# Altium project HYDRA_V4_LINK.PrjPcb (part 1 of 2)
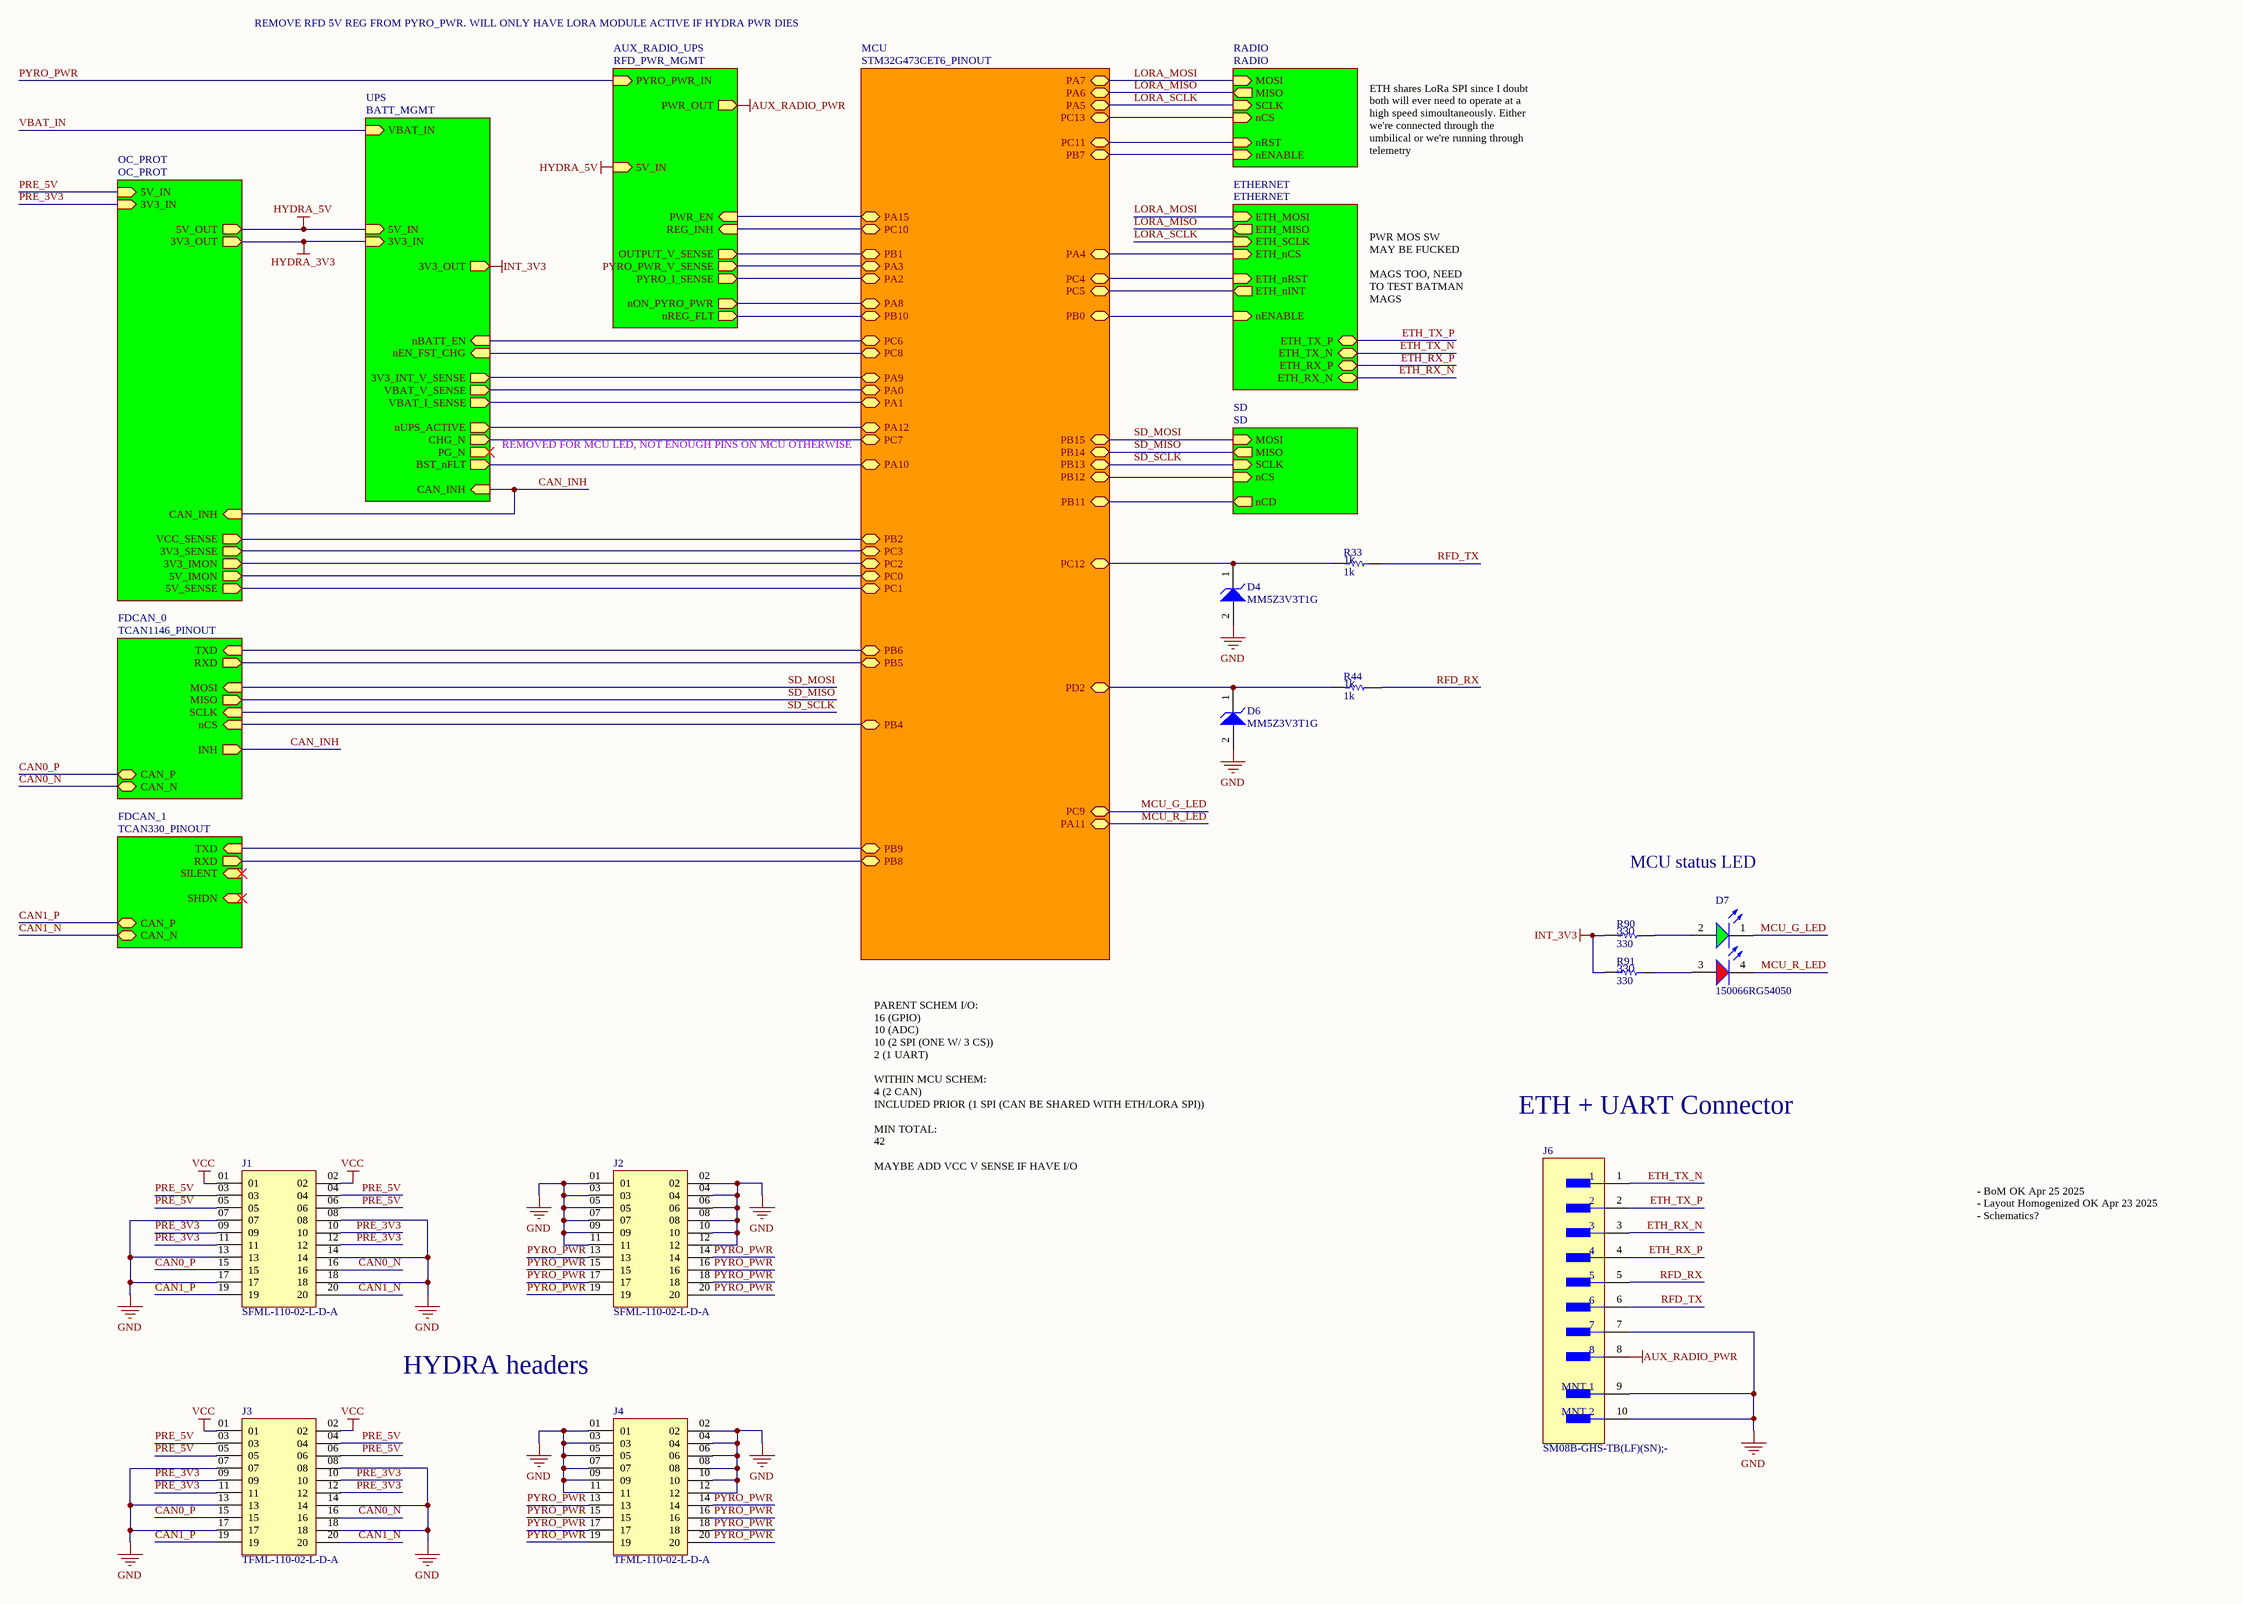
[diagram p0: HYDRA_V4_LINK.SchDoc]
10 sheets, 197 parts. Net scope: hierarchical (ports join the sheet entries above them; power ports are global).
Board files: HYDRA_V4_LINK_OLD.PcbDoc, HYDRA_V4_LINK_V2.PcbDoc
Sheets:
  HYDRA_V4_LINK.SchDoc
    OC_PROT = OC_PROT.SchDoc
    UPS = BATT_MGMT.SchDoc
    MCU = STM32G473CET6_PINOUT.SchDoc
    SD = SD.SchDoc
    AUX_RADIO_UPS = RFD_PWR_MGMT.SchDoc
    ETHERNET = ETHERNET.SchDoc
    RADIO = RADIO.SchDoc
    FDCAN_1 = TCAN330_PINOUT.SchDoc
    FDCAN_0 = TCAN1146_PINOUT.SchDoc

## Sheet HYDRA_V4_LINK.SchDoc
size C; SheetNumber: 1; SheetTotal: 10

### Parts
D4  MM5Z3V3T1G  [ONSC-SOD-523-2-502-01_V]
D6  MM5Z3V3T1G  [ONSC-SOD-523-2-502-01_V]
D7  150066RG54050  [WL-SBCD_0606]
J1  SFML-110-02-L-D-A  [SFML-110-02-L-D-A-Footprint-1]
J2  SFML-110-02-L-D-A  [SFML-110-02-L-D-A-Footprint-1]
J3  TFML-110-02-L-D-A  [TFML-110-02-L-D-A-Footprint-1]
J4  TFML-110-02-L-D-A  [TFML-110-02-L-D-A-Footprint-1]
J6  SM08B-GHS-TB(LF)(SN);-  [SM08B-GHS-TB(LF)(SN);--Footprint-1]
R33  1k  [R0603B]
R44  1k  [R0603B]
R90  330  [R0603B]
R91  330  [R0603B]

### Sub-sheets
AUX_RADIO_UPS = RFD_PWR_MGMT: 5V_IN (in), PYRO_PWR_IN (in), PWR_OUT (out), PWR_EN (in), OUTPUT_V_SENSE (out), PYRO_PWR_V_SENSE (out), PYRO_I_SENSE (out), nON_PYRO_PWR (out), nREG_FLT (out), REG_INH (in)
ETHERNET = ETHERNET: ETH_MOSI (in), ETH_MISO (out), ETH_SCLK (in), ETH_nCS (in), ETH_nRST (in), ETH_nINT (out), ETH_TX_P (bidir), ETH_TX_N (bidir), ETH_RX_P (bidir), ETH_RX_N (bidir), nENABLE (in)
FDCAN_0 = TCAN1146_PINOUT: TXD (in), RXD (out), MOSI (in), MISO (out), SCLK (in), nCS (in), INH (out), CAN_P (bidir), CAN_N (bidir)
FDCAN_1 = TCAN330_PINOUT: TXD (in), RXD (out), SHDN (in), SILENT (in), CAN_P (bidir), CAN_N (bidir)
MCU = STM32G473CET6_PINOUT: PA4 (bidir), PA5 (bidir), PA6 (bidir), PA7 (bidir), PC4 (bidir), PC5 (bidir), PC12 (bidir), PD2 (bidir), PB5 (bidir), PB6 (bidir), PB4 (bidir), PB9 (bidir), PB8 (bidir), PB12 (bidir), PB13 (bidir), PB14 (bidir), PB15 (bidir), PB11 (bidir), PC13 (bidir), PB7 (bidir), PA15 (bidir), PC10 (bidir), PC0 (bidir), PC1 (bidir), PC2 (bidir), PC3 (bidir), PA0 (bidir), PA1 (bidir), PA2 (bidir), PA3 (bidir), PB2 (bidir), PB1 (bidir), PA9 (bidir), PB0 (bidir), PC11 (bidir), PB10 (bidir), PC6 (bidir), PC7 (bidir), PC8 (bidir), PC9 (bidir), PA8 (bidir), PA10 (bidir), PA12 (bidir), PA11 (bidir)
OC_PROT = OC_PROT: 5V_IN (in), 3V3_IN (in), 5V_OUT (out), 3V3_OUT (out), CAN_INH (in), 3V3_SENSE (out), 3V3_IMON (out), 5V_IMON (out), 5V_SENSE (out), VCC_SENSE (out)
RADIO = RADIO: MOSI (in), MISO (out), SCLK (in), nCS (in), nRST (in), nENABLE (in)
SD = SD: MOSI (in), MISO (out), SCLK (in), nCS (in), nCD (out)
UPS = BATT_MGMT: 5V_IN (in), 3V3_IN (in), 3V3_OUT (out), VBAT_IN (in), nBATT_EN (in), nEN_FST_CHG (in), VBAT_V_SENSE (out), 3V3_INT_V_SENSE (out), VBAT_I_SENSE (out), nUPS_ACTIVE (out), CHG_N (out), PG_N (out), BST_nFLT (out), CAN_INH (in)

### Nets
AUX_RADIO_PWR: J6.8 ; sheet AUX_RADIO_UPS/PWR_OUT
GND: D4.2(A) D6.2(A) J1.07 J1.08 J1.13 J1.14 J1.17 J1.18 J2.01 J2.02 J2.03 J2.04 J2.05 J2.06 J2.07 J2.08 J2.09 J2.10 J2.11 J2.12 J3.07 J3.08 J3.13 J3.14 J3.17 J3.18 J4.01 J4.02 J4.03 J4.04 J4.05 J4.06 J4.07 J4.08 J4.09 J4.10 J4.11 J4.12 J6.7 J6.9(MNT_1) J6.10(MNT_2)
HYDRA_3V3: sheet OC_PROT/3V3_OUT, sheet UPS/3V3_IN  [project net 3V3_OUT]
HYDRA_5V: sheet OC_PROT/5V_OUT, sheet UPS/5V_IN, sheet AUX_RADIO_UPS/5V_IN  [project net 5V]
INT_3V3: R90.2 R91.2 ; sheet UPS/3V3_OUT
VCC: J1.01 J1.02 J3.01 J3.02
BATT_TS: sheet UPS/nBATT_EN, sheet MCU/PC6
BST_nFLT: sheet UPS/BST_nFLT, sheet MCU/PA10
CAN0_N: J1.16 J3.16 ; sheet FDCAN_0/CAN_N
CAN0_P: J1.15 J3.15 ; sheet FDCAN_0/CAN_P
CAN1_N: J1.20 J3.20 ; sheet FDCAN_1/CAN_N
CAN1_P: J1.19 J3.19 ; sheet FDCAN_1/CAN_P
CAN_INH: sheet OC_PROT/CAN_INH, sheet UPS/CAN_INH, sheet FDCAN_0/INH
CHG_N: sheet UPS/CHG_N, sheet MCU/PC7
ETH_nCS: sheet MCU/PA4, sheet ETHERNET/ETH_nCS
ETH_nINT: sheet MCU/PC5, sheet ETHERNET/ETH_nINT
ETH_nRST: sheet MCU/PC4, sheet ETHERNET/ETH_nRST
ETH_RX_N: J6.3 ; sheet ETHERNET/ETH_RX_N
ETH_RX_P: J6.4 ; sheet ETHERNET/ETH_RX_P
ETH_TX_N: J6.1 ; sheet ETHERNET/ETH_TX_N
ETH_TX_P: J6.2 ; sheet ETHERNET/ETH_TX_P
ISET2: sheet UPS/nEN_FST_CHG, sheet MCU/PC8
LORA_MISO: sheet MCU/PA6, sheet ETHERNET/ETH_MISO, sheet RADIO/MISO  [project net ETH_MISO]
LORA_MOSI: sheet MCU/PA7, sheet ETHERNET/ETH_MOSI, sheet RADIO/MOSI  [project net ETH_MOSI]
LORA_SCLK: sheet MCU/PA5, sheet ETHERNET/ETH_SCLK, sheet RADIO/SCLK  [project net ETH_SCLK]
MCU_G_LED: D7.1(K) ; sheet MCU/PC9
MCU_R_LED: D7.4(K) ; sheet MCU/PA11
nREG_FLT: sheet MCU/PB10, sheet AUX_RADIO_UPS/nREG_FLT
PRE_3V3: J1.09 J1.10 J1.11 J1.12 J3.09 J3.10 J3.11 J3.12 ; sheet OC_PROT/3V3_IN
PRE_5V: J1.03 J1.04 J1.05 J1.06 J3.03 J3.04 J3.05 J3.06 ; sheet OC_PROT/5V_IN
PYRO_PWR: J2.13 J2.14 J2.15 J2.16 J2.17 J2.18 J2.19 J2.20 J4.13 J4.14 J4.15 J4.16 J4.17 J4.18 J4.19 J4.20 ; sheet AUX_RADIO_UPS/PYRO_PWR_IN
RFD_RX: J6.5 R44.1
RFD_TX: J6.6 R33.1
SD_CD: sheet MCU/PB11, sheet SD/nCD
SD_CS: sheet MCU/PB12, sheet SD/nCS
SD_MISO: sheet MCU/PB14, sheet SD/MISO, sheet FDCAN_0/MISO  [project net SD_DAT0]
SD_MOSI: sheet MCU/PB15, sheet SD/MOSI, sheet FDCAN_0/MOSI  [project net SD_CMD]
SD_SCLK: sheet MCU/PB13, sheet SD/SCLK, sheet FDCAN_0/SCLK  [project net SD_CLK]
NetD4_1: D4.1(K) R33.2 ; sheet MCU/PC12
NetD6_1: D6.1(K) R44.2 ; sheet MCU/PD2
NetD7_2: D7.2(A) R90.1
NetD7_3: D7.3(A) R91.1
NetQ3_2: sheet MCU/PC10, sheet AUX_RADIO_UPS/REG_INH
NetQ3_5: sheet MCU/PA15, sheet AUX_RADIO_UPS/PWR_EN
NetR3_1: sheet OC_PROT/5V_SENSE, sheet MCU/PC1
NetR5_1: sheet OC_PROT/5V_IMON, sheet MCU/PC0
NetR11_1: sheet OC_PROT/3V3_SENSE, sheet MCU/PC3
NetR13_1: sheet OC_PROT/3V3_IMON, sheet MCU/PC2
NetR24_2: sheet UPS/VBAT_V_SENSE, sheet MCU/PA0
NetR27_2: sheet UPS/nUPS_ACTIVE, sheet MCU/PA12
NetR28_2: sheet UPS/3V3_INT_V_SENSE, sheet MCU/PA9
NetR34_1: sheet MCU/PB7, sheet RADIO/nENABLE
NetR42_1: sheet MCU/PA3, sheet AUX_RADIO_UPS/PYRO_PWR_V_SENSE
NetR56_1: sheet MCU/PB1, sheet AUX_RADIO_UPS/OUTPUT_V_SENSE
NetR58_2: sheet MCU/PA8, sheet AUX_RADIO_UPS/nON_PYRO_PWR
NetR81_1: sheet MCU/PB0, sheet ETHERNET/nENABLE
NetR83_1: sheet OC_PROT/VCC_SENSE, sheet MCU/PB2
NetU4_11: sheet UPS/VBAT_I_SENSE, sheet MCU/PA1
NetU7_4: sheet MCU/PC11, sheet RADIO/nRST
NetU7_15: sheet MCU/PC13, sheet RADIO/nCS
NetU8_11: sheet MCU/PA2, sheet AUX_RADIO_UPS/PYRO_I_SENSE
NetU12_57: sheet MCU/PB4, sheet FDCAN_0/nCS
NetU12_58: sheet MCU/PB5, sheet FDCAN_0/RXD
NetU12_59: sheet MCU/PB6, sheet FDCAN_0/TXD
NetU12_61: sheet MCU/PB8, sheet FDCAN_1/RXD
NetU12_62: sheet MCU/PB9, sheet FDCAN_1/TXD

### Notes on the sheet
- REMOVE RFD 5V REG FROM PYRO_PWR. WILL ONLY HAVE LORA MODULE ACTIVE IF HYDRA PWR DIES
- ETH shares LoRa SPI since I doubt both will ever need to operate at a high speed simoultaneously. Either we're connected through the umbilical or we're running through telemetry
- PWR MOS SW MAY BE FUCKED
  MAGS TOO, NEED TO TEST BATMAN MAGS
- REMOVED FOR MCU LED, NOT ENOUGH PINS ON MCU OTHERWISE
- MCU status LED
- ETH + UART Connector
- PARENT SCHEM I/O:
  16 (GPIO)
  10 (ADC)
  10 (2 SPI (ONE W/ 3 CS))
  2 (1 UART)
  WITHIN MCU SCHEM:
  4 (2 CAN)
  INCLUDED PRIOR (1 SPI (CAN BE SHARED WITH ETH/LORA SPI))
  MIN TOTAL:
  42
  MAYBE ADD VCC V SENSE IF HAVE I/O
- - BoM OK Apr 25 2025
  - Layout Homogenized OK Apr 23 2025
  - Schematics?
- HYDRA headers

### Library data of the parts
D4 D6 = CMP-1060-00750-1: Zener Voltage Regulator, 500 mW, 2-Pin SOD-523, Pb-Free, Tape and Reel; Manufacturer: On Semiconductor; P Max (W): 0.5; VZ Typ (V): 3.3; RoHS: Pb-Free; ComponentLink2Description: Datasheet; PackageReference: SOD-523-2-502-01; DatasheetVersion: Rev. 10; ComponentLink1Description: Manufacturer URL; PackageVersion: Rev. E, 09/2010; ComponentLink3URL: http://www.onsemi.com/pub_link/Collateral/502-01.PDF; ComponentLink2URL: http://www.onsemi.cn/pub_link/Collateral/MM5Z2V4T1-D.PDF; Mounting Technology: Surface Mount; PartNumber: MM5Z3V3T1G; Packing: Tape and Reel; PackageDescription: 2-Pin SOD, Body 1.2 x 0.8 mm; ComponentLink1URL: http://www.onsemi.com/; ComponentLink3Description: Package Specification
D7 = CMP-004-00040-2: Led, Red/Grn, 180Mcd/230Mcd, 624Nm/525Nm Rohs Compliant: Yes; Source: rgled.SchLib; Component Type: Standard; Design Item ID: CMP-004-00034-2; Pins: 4
J1 J2 = CMP-002-00043-1: Board Connector, 20 Contact(s), 2 Row(s), Female, Straight, 0.05 inch Pitch, Surface Mount Terminal, Locking, Black Insulator, Socket; RoHS Compliant: Yes; Connector Type: BOARD CONNECTOR; Mounting Technology: Board
J3 J4 = CMP-002-00042-3: Board Connector, 20 Contact(s), 2 Row(s), Male, Straight, Surface Mount Terminal; Connector Type: BOARD CONNECTOR; Mounting Technology: Board; RoHS Compliant: Yes
J6 = CMP-002-00079-3: Connector Header, GH Series, 8 Position, 1.25mm, 30-26 AWG, 50V, Surface Mount, Right Angle, Solder, Locking Ramp
R33 R44 R90 R91 = CMP-009-00002-14: Resistor
  R33 R44: Value: 1k
  R90 R91: Value: 330

## Sheet OC_PROT.SchDoc
size C; SheetNumber: 2; SheetTotal: 10
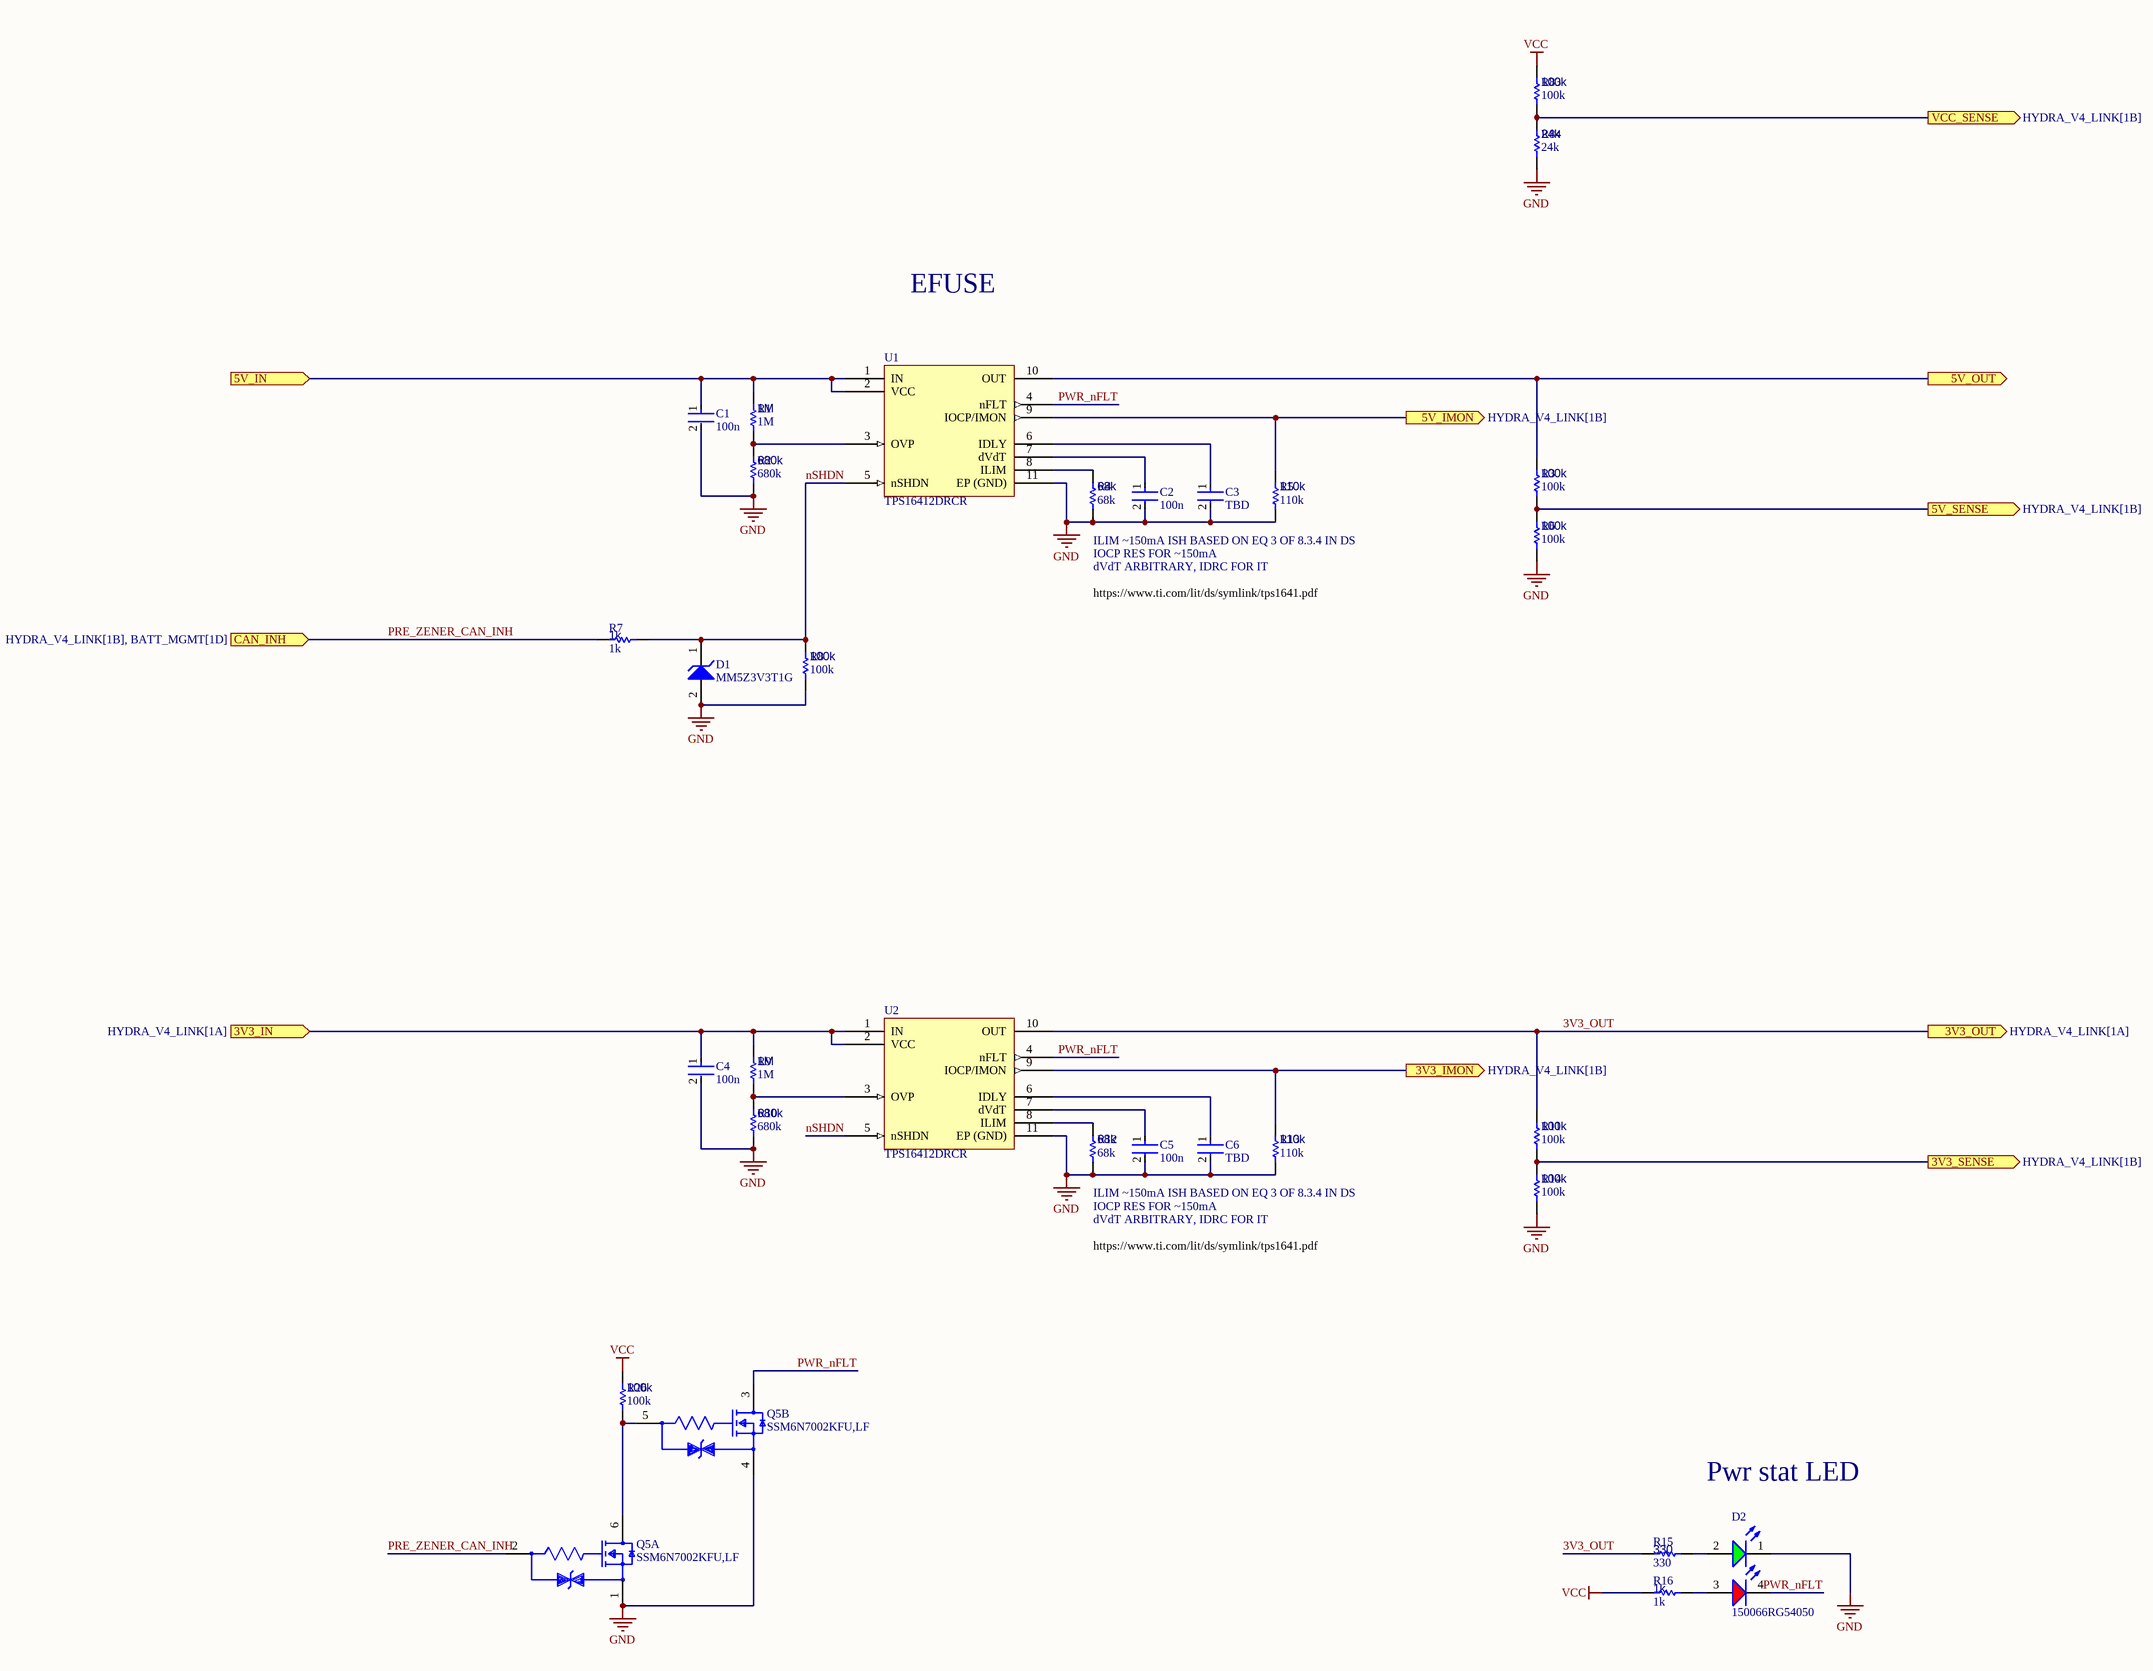
[diagram p1: OC_PROT.SchDoc]

### Parts
C1  100n  [FP-0402-L_1_0_0_05-W_0_5-IPC_A]
C2  100n  [FP-0402-L_1_0_0_05-W_0_5-IPC_A]
C3  TBD  [FP-0402-L_1_0_0_05-W_0_5-IPC_A]
C4  100n  [FP-0402-L_1_0_0_05-W_0_5-IPC_A]
C5  100n  [FP-0402-L_1_0_0_05-W_0_5-IPC_A]
C6  TBD  [FP-0402-L_1_0_0_05-W_0_5-IPC_A]
D1  MM5Z3V3T1G  [ONSC-SOD-523-2-502-01_V]
D2  150066RG54050  [WL-SBCD_0606]
Q5  SSM6N7002KFU,LF  [FP-SSOP6-P-0_65A-MFG]  (parts A,B of 2)
R1  1M  [R0603B]
R2  680k  [R0603B]
R3  100k  [R0603B]
R4  68k  [R0603B]
R5  110k  [R0603B]
R6  100k  [R0603B]
R7  1k  [R0603B]
R8  100k  [R0603B]
R9  1M  [R0603B]
R10  680k  [R0603B]
R11  100k  [R0603B]
R12  68k  [R0603B]
R13  110k  [R0603B]
R14  100k  [R0603B]
R15  330  [R0603B]
R16  1k  [R0603B]
R26  100k  [R0603B]
R83  100k  [R0603B]
R84  24k  [R0603B]
U1  TPS16412DRCR  [PSON50P300X100_HS-11N]
U2  TPS16412DRCR  [PSON50P300X100_HS-11N]

### Ports
3V3_IMON (out, see HYDRA_V4_LINK[1B]), 3V3_IN (in, see HYDRA_V4_LINK[1A]), 3V3_OUT (out, see HYDRA_V4_LINK[1A]), 3V3_SENSE (out, see HYDRA_V4_LINK[1B]), 5V_IMON (out, see HYDRA_V4_LINK[1B]), 5V_IN (in, see HYDRA_V4_LINK[1A]), 5V_OUT (out, see HYDRA_V4_LINK[1A]), 5V_SENSE (out, see HYDRA_V4_LINK[1B]), CAN_INH (in, see HYDRA_V4_LINK[1B], BATT_MGMT[1D]), VCC_SENSE (out, see HYDRA_V4_LINK[1B])

### Nets
3V3_OUT: R11.2 R15.1 U2.10(OUT) ; port 3V3_OUT
5V: R3.2 U1.10(OUT) ; port 5V_OUT
GND: C1.2 C2.2 C3.2 C4.2 C5.2 C6.2 D1.2(A) D2.1(K) Q5.1(Source1) Q5.4(Source2) R2.2 R4.2 R5.2 R6.1 R8.1 R10.2 R12.2 R13.2 R14.1 R84.1 U1.11(EP_(GND)) U2.11(EP_(GND))
VCC: R16.1 R26.1 R83.2
nSHDN: D1.1(K) R7.1 R8.2 U1.5(nSHDN) U2.5(nSHDN)
PRE_3V3: C4.1 R9.1 U2.1(IN) U2.2(VCC) ; port 3V3_IN
PRE_5V: C1.1 R1.1 U1.1(IN) U1.2(VCC) ; port 5V_IN
PRE_ZENER_CAN_INH: Q5.2(Gate1) R7.2 ; port CAN_INH  [project net CAN_INH]
PWR_nFLT: D2.4(K) Q5.3(Drain2) U1.4(nFLT) U2.4(nFLT)
NetC2_1: C2.1 U1.7(dVdT)
NetC3_1: C3.1 U1.6(IDLY)
NetC5_1: C5.1 U2.7(dVdT)
NetC6_1: C6.1 U2.6(IDLY)
NetD2_2: D2.2(A) R15.2
NetD2_3: D2.3(A) R16.2
NetQ5_5: Q5.5(Gate2) Q5.6(Drain1) R26.2
NetR1_2: R1.2 R2.1 U1.3(OVP)
NetR3_1: R3.1 R6.2 ; port 5V_SENSE
NetR4_1: R4.1 U1.8(ILIM)
NetR5_1: R5.1 U1.9(IOCP/IMON) ; port 5V_IMON
NetR9_2: R9.2 R10.1 U2.3(OVP)
NetR11_1: R11.1 R14.2 ; port 3V3_SENSE
NetR12_1: R12.1 U2.8(ILIM)
NetR13_1: R13.1 U2.9(IOCP/IMON) ; port 3V3_IMON
NetR83_1: R83.1 R84.2 ; port VCC_SENSE

### Notes on the sheet
- EFUSE
- ILIM ~150mA ISH BASED ON EQ 3 OF 8.3.4 IN DS
- dVdT ARBITRARY, IDRC FOR IT
- IOCP RES FOR ~150mA
- https://www.ti.com/lit/ds/symlink/tps1641.pdf
- Pwr stat LED

### Library data of the parts
C1-C6 = CMP-001-00058-1: LARGE PADS, 0402 CAP, CHANGE COMMENT TO MATCH REAL P/N; Capacitor Type: Ceramic; Min Operating Temperature: -55°C; Mounting Technology: Surface Mount; Pins: 2; Case/Package: 0402; RoHS Compliant: Yes; Max Operating Temperature: 85°C
  C1 C2 C4 C5: Value: 100n
  C3 C6: Value: TBD
D1 = CMP-1060-00750-1: as D4 on sheet HYDRA_V4_LINK; RoHS: Pb-Free; ComponentLink2Description: Datasheet; PackageReference: SOD-523-2-502-01; DatasheetVersion: Rev. 10; ComponentLink1Description: Manufacturer URL; PackageVersion: Rev. E, 09/2010; ComponentLink3URL: http://www.onsemi.com/pub_link/Collateral/502-01.PDF; ComponentLink2URL: http://www.onsemi.cn/pub_link/Collateral/MM5Z2V4T1-D.PDF; Mounting Technology: Surface Mount; PartNumber: MM5Z3V3T1G; Packing: Tape and Reel; PackageDescription: 2-Pin SOD, Body 1.2 x 0.8 mm; ComponentLink1URL: http://www.onsemi.com/; ComponentLink3Description: Package Specification
D2 = CMP-004-00040-2: as D7 on sheet HYDRA_V4_LINK; Source: rgled.SchLib; Component Type: Standard; Design Item ID: CMP-004-00034-2; Pins: 4
Q5 = CMP-006-0005-1: Transistor MOSFET Array Dual N-CH 60V 300mA 6-Pin SOT-363 Emboss T/R; Max Power Dissipation: 285mW; Input Capacitance: 40pF; FET Type: 2 N-Channel; Rds On Max: 1.5R; Mounting Technology: Surface Mount; Continuous Drain Current (ID): 300mA; Drain to Source Voltage (Vdss): 60V; Packaging: Cut Tape; Series: -
R1-R16 R26 R83 R84 = CMP-009-00002-14: Resistor
  R1 R9: Value: 1M
  R2 R10: Value: 680k
  R3 R6 R8 R11 R14 R26 R83: Value: 100k
  R4 R12: Value: 68k
  R5 R13: Value: 110k
  R7 R16: Value: 1k
  R15: Value: 330
  R84: Value: 24k
U1 U2 = CMP-019-00048-3: 2.7-V to 40-V 152-mΩ 1.8-A eFuse with output power limiting 10-VSON -40 to 125

## Sheet BATT_MGMT.SchDoc
size C; SheetNumber: 3; SheetTotal: 10
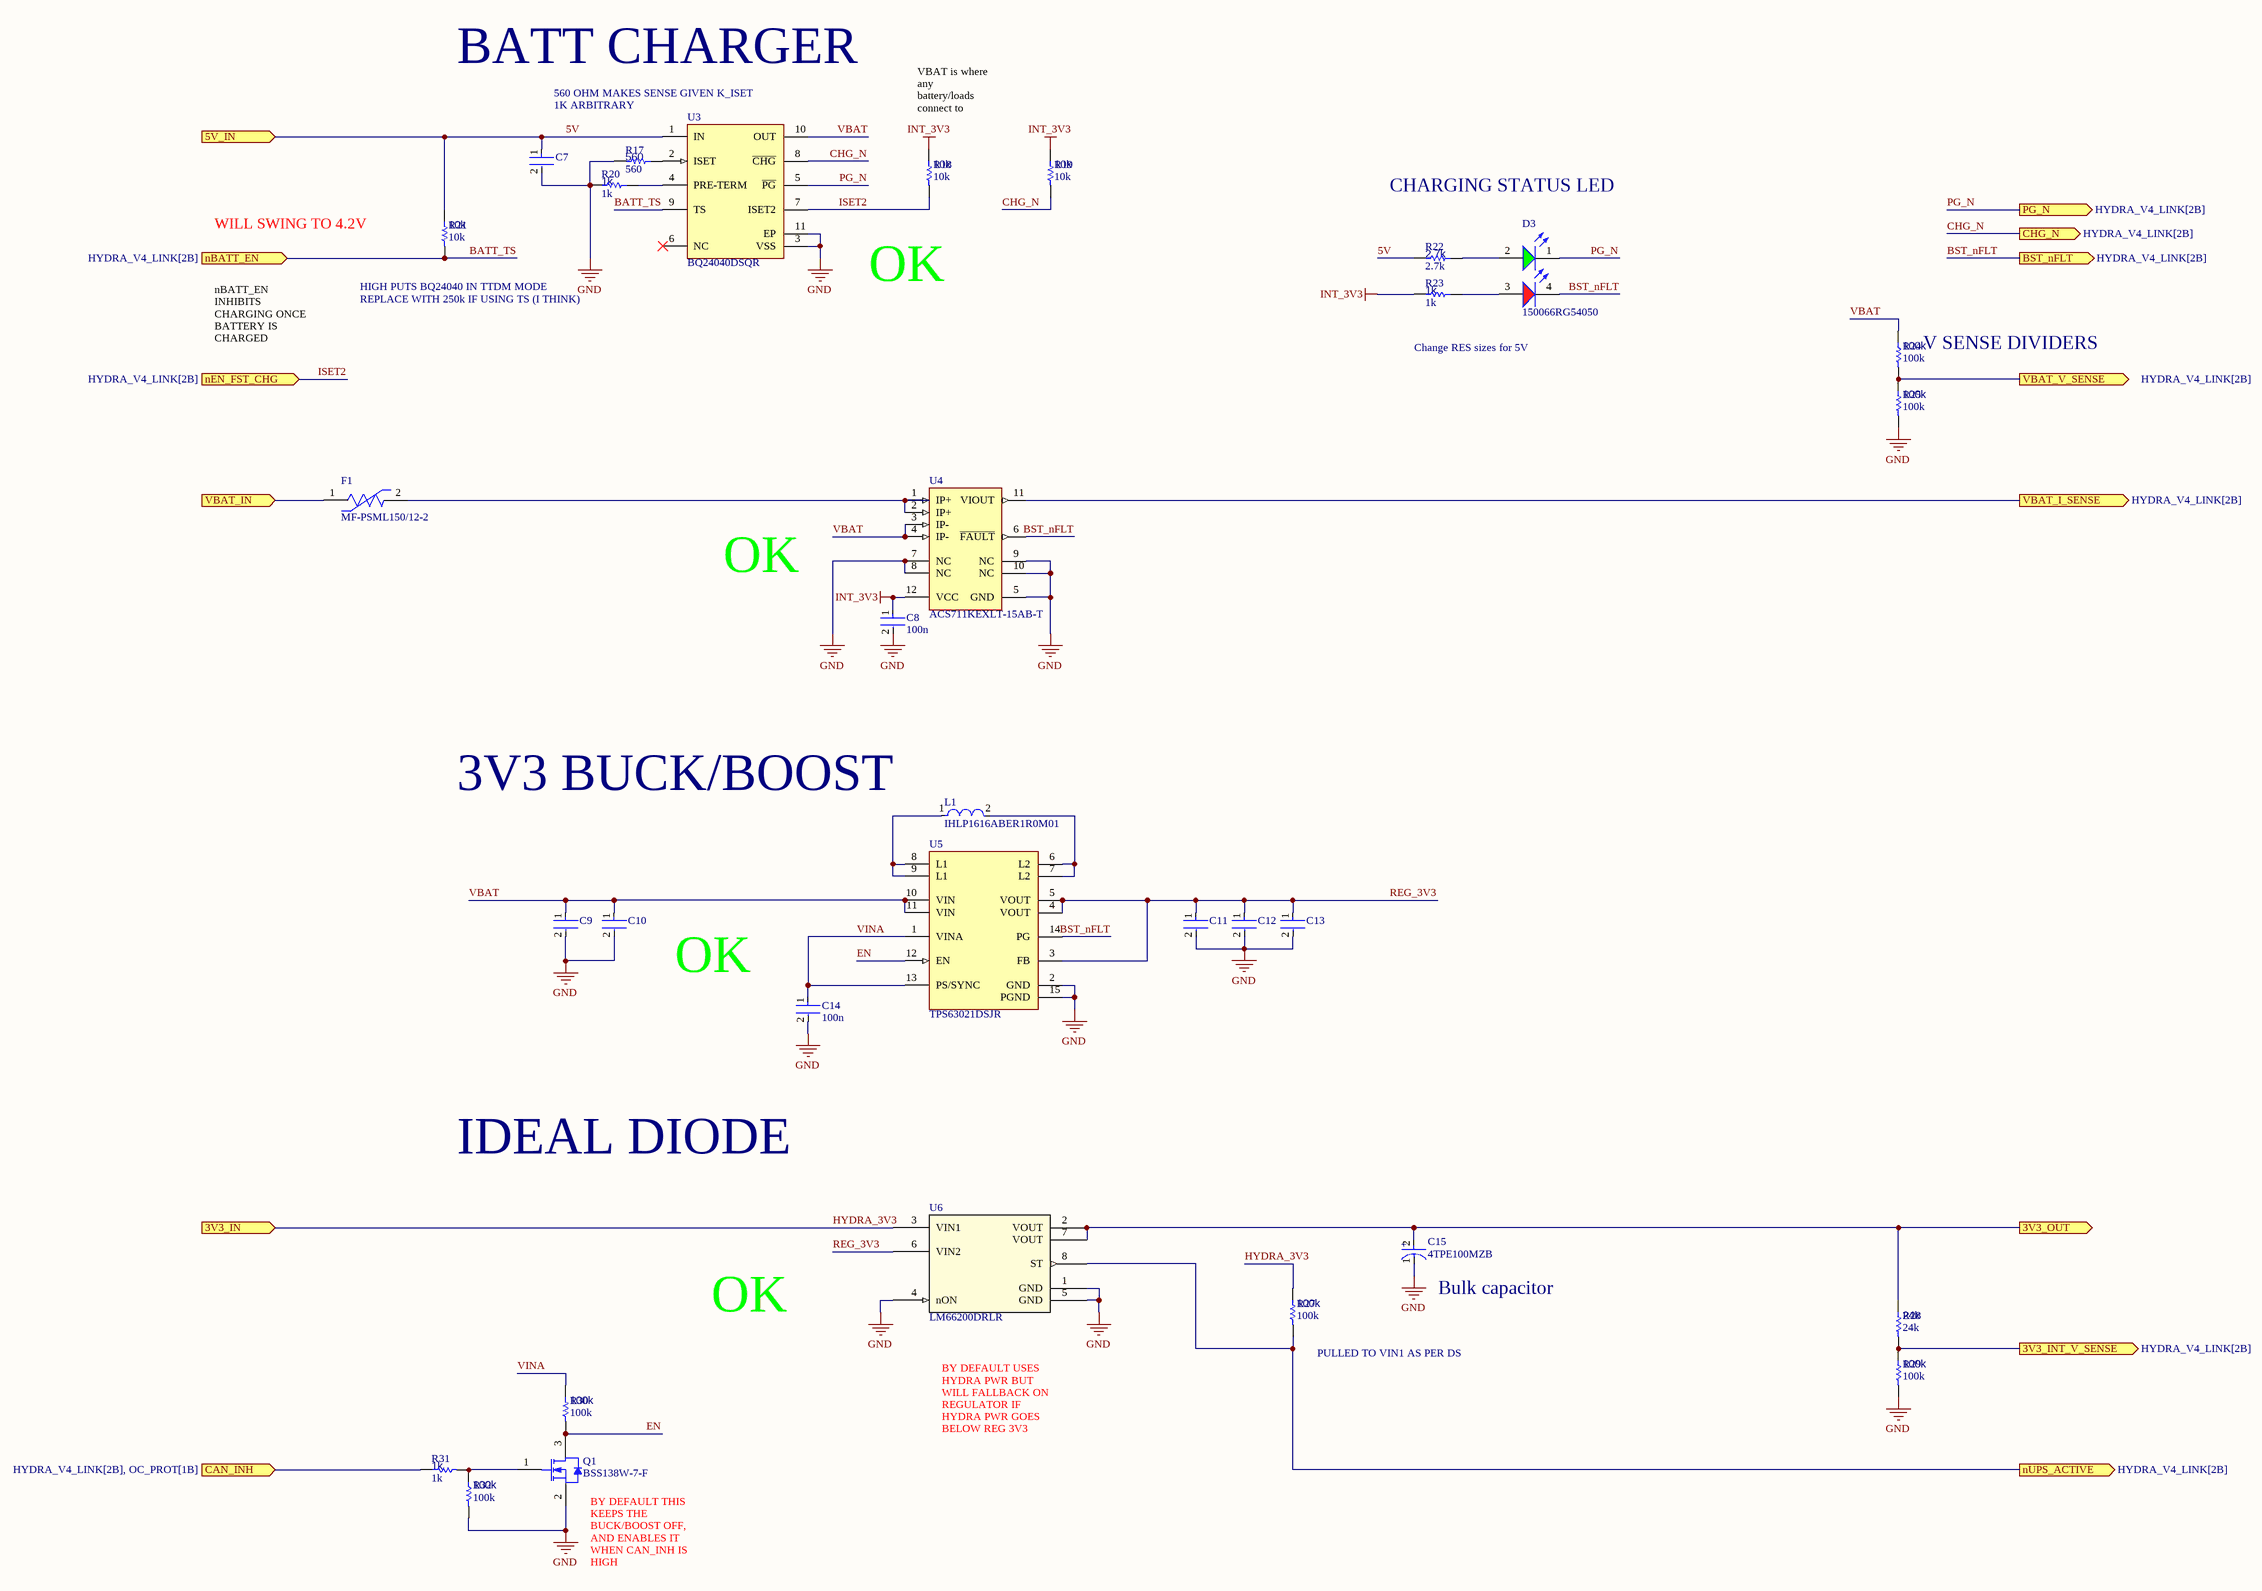
[diagram p2: BATT_MGMT.SchDoc]

### Parts
C7  C0805C106K8PACTU  [FP-C0805C-DG-MFG]  (value not drawn)
C8  100n  [FP-0402-L_1_0_0_05-W_0_5-IPC_A]
C9  C0805C106K8PACTU  [FP-C0805C-DG-MFG]  (value not drawn)
C10  C0805C106K8PACTU  [FP-C0805C-DG-MFG]  (value not drawn)
C11  GRM21BR60J226ME39L  [FP-GRM21B-0_15-MFG]  (value not drawn)
C12  GRM21BR60J226ME39L  [FP-GRM21B-0_15-MFG]  (value not drawn)
C13  GRM21BR60J226ME39L  [FP-GRM21B-0_15-MFG]  (value not drawn)
C14  100n  [FP-0402-L_1_0_0_05-W_0_5-IPC_A]
C15  4TPE100MZB  [FP-POSCAP-B2-MFG]
D3  150066RG54050  [WL-SBCD_0606]
F1  MF-PSML150/12-2  [FP-MF-PSMF-MFG]
L1  IHLP1616ABER1R0M01  [FP-IHLP-1616AB-FP_1_8545x-MFG]
Q1  BSS138W-7-F  [DIOD-SOT323-3_V]
R17  560  [R0603B]
R18  10k  [R0603B]
R19  10k  [R0603B]
R20  1k  [R0603B]
R21  10k  [R0603B]
R22  2.7k  [R0603B]
R23  1k  [R0603B]
R24  100k  [R0603B]
R25  100k  [R0603B]
R27  100k  [R0603B]
R28  24k  [R0603B]
R29  100k  [R0603B]
R30  100k  [R0603B]
R31  1k  [R0603B]
R32  100k  [R0603B]
U3  BQ24040DSQR  [DSQ0010A_V]
U4  ACS711KEXLT-15AB-T  [ALEG-EX-12_V]
U5  TPS63021DSJR  [FP-DSJ0014A-MFG]
U6  LM66200DRLR  [LM66200DRLR-Footprint-1]

### Ports
3V3_IN (in, see HYDRA_V4_LINK[2A]), 3V3_INT_V_SENSE (out, see HYDRA_V4_LINK[2B]), 3V3_OUT (out, see HYDRA_V4_LINK[2A]), 5V_IN (in, see HYDRA_V4_LINK[2A], RFD_PWR_MGMT[1C]), BST_nFLT (out, see HYDRA_V4_LINK[2B]), CAN_INH (in, see HYDRA_V4_LINK[2B], OC_PROT[1B]), CHG_N (out, see HYDRA_V4_LINK[2B]), nBATT_EN (in, see HYDRA_V4_LINK[2B]), nEN_FST_CHG (in, see HYDRA_V4_LINK[2B]), nUPS_ACTIVE (out, see HYDRA_V4_LINK[2B]), PG_N (out, see HYDRA_V4_LINK[2B]), VBAT_I_SENSE (out, see HYDRA_V4_LINK[2B]), VBAT_IN (in, see HYDRA_V4_LINK[2A]), VBAT_V_SENSE (out, see HYDRA_V4_LINK[2B])

### Nets
5V: C7.1 R21.1 R22.2 U3.1(IN) ; port 5V_IN
GND: C7.2 C8.2 C9.2 C10.2 C11.2 C12.2 C13.2 C14.2 C15.1(C) Q1.2(S) R17.2 R20.2 R25.2 R29.2 R32.2 U3.3(VSS) U3.11(EP) U4.5(GND) U4.7(NC) U4.8(NC) U4.9(NC) U4.10(NC) U5.2(GND) U5.15(PGND) U6.1(GND) U6.4(nON) U6.5(GND)
HYDRA_3V3: R27.1 U6.3(VIN1) ; port 3V3_IN  [project net 3V3_OUT]
INT_3V3: C8.1 C15.2(A) R18.1 R19.1 R23.2 R28.1 U4.12(VCC) U6.2(VOUT) U6.7(VOUT) ; port 3V3_OUT
BATT_TS: R21.2 U3.9(TS) ; port nBATT_EN
BST_nFLT: D3.4(K) U4.6(~{FAULT}) U5.14(PG) ; port BST_nFLT
CAN_INH: R31.1 ; port CAN_INH
CHG_N: R19.2 U3.8(~{CHG}) ; port CHG_N
EN: Q1.3(D) R30.2 U5.12(EN)
ISET2: R18.2 U3.7(ISET2) ; port nEN_FST_CHG
PG_N: D3.1(K) U3.5(~{PG}) ; port PG_N
REG_3V3: C11.1 C12.1 C13.1 U5.3(FB) U5.4(VOUT) U5.5(VOUT) U6.6(VIN2)
VBAT: C9.1 C10.1 R24.1 U3.10(OUT) U4.3(IP-) U4.4(IP-) U5.10(VIN) U5.11(VIN)
VBAT_IN: F1.1 ; port VBAT_IN
VINA: C14.1 R30.1 U5.1(VINA) U5.13(PS/SYNC)
NetD3_2: D3.2(A) R22.1
NetD3_3: D3.3(A) R23.1
NetF1_2: F1.2 U4.1(IP+) U4.2(IP+)
NetL1_1: L1.1 U5.8(L1) U5.9(L1)
NetL1_2: L1.2 U5.6(L2) U5.7(L2)
NetQ1_1: Q1.1(G) R31.2 R32.1
NetR17_1: R17.1 U3.2(ISET)
NetR20_1: R20.1 U3.4(PRE-TERM)
NetR24_2: R24.2 R25.1 ; port VBAT_V_SENSE
NetR27_2: R27.2 U6.8(ST) ; port nUPS_ACTIVE
NetR28_2: R28.2 R29.1 ; port 3V3_INT_V_SENSE
NetU4_11: U4.11(VIOUT) ; port VBAT_I_SENSE

Not connected (* = marked no-connect by the designer): U3 6(NC)*

### Notes on the sheet
- BATT CHARGER
- (near U3) 560 OHM MAKES SENSE GIVEN K_ISET
- 1K ARBITRARY
- VBAT is where any battery/loads connect to
- CHARGING STATUS LED
- WILL SWING TO 4.2V
- nBATT_EN INHIBITS CHARGING ONCE BATTERY IS CHARGED
- (near R21) HIGH PUTS BQ24040 IN TTDM MODE
- REPLACE WITH 250k IF USING TS (I THINK)
- OK
- Change RES sizes for 5V
- (near R24) V SENSE DIVIDERS
- 3V3 BUCK/BOOST
- IDEAL DIODE
- (near C15) Bulk capacitor
- (near R27) PULLED TO VIN1 AS PER DS
- BY DEFAULT USES HYDRA PWR BUT WILL FALLBACK ON REGULATOR IF HYDRA PWR GOES BELOW REG 3V3
- (near Q1) BY DEFAULT THIS KEEPS THE BUCK/BOOST OFF, AND ENABLES IT WHEN CAN_INH IS HIGH
- (in symbol CMP-05428-001141-1) +

### Library data of the parts
C7 C9 C10 = CMP-2007-03243-2: CAP CER 10UF 10V X5R 0805; Manufacturer: Kemet; 3DS Part Number: 220-00001; Tolerance: 10%; Temperature Coefficient: 15%; Material: Ceramic; Device Class L2: Capacitors; Device Class L1: Passive Components; ComponentLink2URL: https://content.kemet.com/datasheets/KEM_C1006_X5R_SMD.pdf; Height: 1.4mm; Lead Free: Yes; Manufacturer Part Number: C0805C106K8PACTU; Digikey Description: CAP CER 10UF 10V X5R 0805; Octopart: https://octopart.com/c0805c106k8pactu-kemet-98697; Capacitance: 10uF; Value: C0805C106K8PACTU; Temperature Range Low: -55°C; Temperature: -55°C to +85°C; Automotive: No; Mouser Description: CAP CER 10UF 10V X5R 0805; Ipc Land Pattern Name: CAPC200125X125; Temperature Range High: +85°C; Voltage: 10V; RoHS: TRUE; Device Class L3: Ceramic Capacitors; ComponentLink2Description: Datasheet; Voltage Rating: 10V; Package: C0805C-DG; Temperature Characteristic: X5R; Category: Cap
C8 C14 = CMP-001-00058-1: as C1 on sheet OC_PROT; Value: 100n; Min Operating Temperature: -55°C; Mounting Technology: Surface Mount; Pins: 2; Case/Package: 0402; RoHS Compliant: Yes; Max Operating Temperature: 85°C
C11-C13 = CMP-2007-03385-2: Chip Multilayer Ceramic Capacitors for General Purpose, 0805, 22uF, X5R, 15%, 20%, 6.3V; Material: Ceramic; Max Operating Temperature: 85°C; Voltage: 6.3V; Min Operating Temperature: -55°C; Case/Package: 0805; Thickness: 0.053inch; Dielectric: X5R; Packaging: Tape and Reel; Depth: 1.25mm; Termination: SMD/SMT; Voltage Rating (DC): 6.3V; Radiation Hardening: No; Tolerance: 20%; Mount: Surface Mount; Lead Free: Lead Free; Package Quantity: 1; REACH SVHC: No SVHC; Voltage Rating: 6.3V; Capacitance: 22uF; Length: 2mm; Case Code (Imperial): 0805; Case Code (Metric): 2012; Width: 0.049inch; Height: 1.25mm; Value: GRM21BR60J226ME39L
C15 = CMP-05428-001141-1: Molded Tantalum Polymer Capacitor 100uF 20% 4V life 1000Hours SMD 1411; Leakage Current: 40uA; Polarity: Polar; Dissipation Factor: 8%; ESR (Equivalent Series Resistance): 35mR; Ripple Current: 1.4A; Capacitance: 100uF; Voltage: 4V; Voltage Rating (DC): 4V; Package Quantity: 2000; Packaging: Tape and Reel; RoHS Compliant: Yes; Voltage Rating: 4V; Case Code (Imperial): 1210; Construction: Flat; Max Operating Temperature: 105°C; Termination: SMD/SMT; Case Code (Metric): 3528; Case/Package: Molded; Tolerance: 20%; Min Operating Temperature: -55°C; Lead Free: Lead Free; Features: General Purpose; Height: 1.9mm; Length: 3.5mm; Series: POSCAP™ TPE; Number of Pins: 2; Height - Seated (Max): 0.079inch; Mount: Surface Mount; Width: 2.8mm; REACH SVHC: No SVHC; Radiation Hardening: No; Depth: 2.8mm; Value: 4TPE100MZB
D3 = CMP-004-00040-2: as D7 on sheet HYDRA_V4_LINK; Source: rgled.SchLib; Component Type: Standard; Design Item ID: CMP-004-00034-2; Pins: 4
F1 = CMP-07400-000013-1: Manufacturer Part Number: MF-PSMF050X-2; Manufacturer: Bourns Inc.; Trip Current: 1A; Trip Time: 0.1s; Value: 0.15-0.9Ω; Hold Current: 0.5A; Current Rating: 40A; Voltage Rating: 6V; Category: Fuse; Temperature: -40°C to +85°C; ComponentLink2Description: Datasheet; Temperature Range High: +85°C; Package: MF-PSMF; Device Class L1: Circuit Protection; Lead Free: Yes; ComponentLink2URL: https://www.bourns.com/docs/product-datasheets/mfpsmf.pdf?sfvrsn=9c05cafe_24; Ambient Temperature Range Low: -40°C; Mouser Description: Resettable Fuses - PPTC .50A 6V 0.15ohm Hold .5 Trip 1; Resistance: 0.15-0.9Ω; Automotive: Yes; Ambient Temperature Range High: +85°C; Device Class L2: PTC Resettable Fuses; Temperature Range Low: -40°C; Device Class L3: unset; Octopart: https://octopart.com/mf-psmf050x-2-bourns-7483438; Digikey Description: PTC RESET FUSE 6V 500MA 0805; Height: 0.85mm; RoHS: TRUE
L1 = CMP-02424-000161-1: Fixed Inductors Commercial High Saturation Series SMT 1uH 4A 52.5mΩ 20%; Test Frequency: 100kHz; Max DC Current: 8.5A; Shielding: Shielded; Core Material: Metal; Self Resonant Frequency: 64MHz; Saturation Current: 7A; DC Resistance (DCR): 52.5mR; Radiation Hardening: No; Height - Seated (Max): 0.047inch; Case Code (Imperial): 1616; Case Code (Metric): 4040; Width: 0.16inch; Case/Package: 1616; Depth: 4.31mm; Height: 1.2mm; Inductance Tolerance: 20%; Lead Free: Lead Free; Termination: SMD/SMT; Military Standard: Not; RMS Current (Irms): 4A; Inductance: 1uH; Length: 4.7mm; Package Quantity: 4000; Number of Pins: 1616; Max Operating Temperature: 125°C; Contact Plating: Tin; Tolerance: 20%; Packaging: Tape and Reel; Current Rating: 4A; Min Operating Temperature: -55°C; Mount: Surface Mount
Q1 = CMP-2000-05968-1: N-Channel Enhancement Mode Mosfet, 50 V, 200 mA, -55 to 150 degC, 6-Pin SOT-323, RoHS, Tape and Reel; Typical Turn-Off Delay Time: 20ns; Number of Channels: 1Channel; Type: EnhancementModeFieldEffectTransistor; Brand: DiodesIncorporated; Vds - Drain-Source Breakdown Voltage: 75V; Vgs - Gate-Source Voltage: 20V; Rds On - Drain-Source Resistance: 1.4Ohms; Transistor Type: 1N-Channel; Configuration: Single; Unit Weight: 0.000212oz; Pd - Power Dissipation: 200mW; Id - Continuous Drain Current: 200mA; Forward Transconductance - Min: 0.1S; Manufacturer URL: http://www.diodes.com/; Series: BSS138; Package Description: 3-Pin Small Outline Transistor, Body 2 x 1.25 mm, Pitch 0.65 mm; Mounting Technology: SurfaceMount; Product Category: MOSFET; RoHS: True; Maximum Operating Temperature: +150C; Height: 1mm; Length: 2.2mm; Technology: Si; Width: 1.35mm; Datasheet URL: http://www.diodes.com/_files/datasheets/ds30206.pdf; Manufacturer: DiodesIncorporated; Package / Case: SOT-323-3; Typical Turn-On Delay Time: 20ns; Transistor Polarity: N-Channel; Factory Pack Quantity: 3000; Packaging: Reel; Product: MOSFETSmallSignal; Datasheet Version: Rev. 11-2, 09/2013; Package Reference: SOT323; Minimum Operating Temperature: -55C; Mounting Style: SMD/SMT; Channel Mode: Enhancement
R17-R25 R27-R32 = CMP-009-00002-14: Resistor
  R17: Value: 560
  R18 R19 R21: Value: 10k
  R20 R23 R31: Value: 1k
  R22: Value: 2.7k
  R24 R25 R27 R29 R30 R32: Value: 100k
  R28: Value: 24k
U3 = CMP-0321-00456-2: 800 mA, Single-Input, Single Cell Li-Ion Battery Charger with Auto Start. Vovp=6.6 V, 3.5 V, -40 to 85 degC, 10-pin SON (DSQ), Green (RoHS & no Sb/Br); Manufacturer: Texas Instruments; NiCd: N; Vin(Min)(V): 3.5; SubFamily: Battery Charge Management; PackageDescription: 10-Pin Plastic Small Outline No-Lead, 2 x 2 x 0.8 mm Body, 0.4 mm Pitch, Exposed Pad; PackageVersion: revB, Apr-2010; Mounting Technology: Surface Mount; Eco-Plan: Green (RoHS & no Sb/Br); ComponentLink1URL: http://www.ti.com/general/docs/lit/getliterature.tsp?genericPartNumber=BQ24040&fileType=pdf; PartNumber: BQ24040DSQR; DatasheetVersion: SLUS941A; Over Voltage Protection: N; PackageReference: DSQ0010A; NiMH: N; Li-Ion: N; Lead Acid: N; Li-Polymer: N; ComponentLink1Description: Datasheet
U4 = CMP-1557-00001-1: Hall Effect Linear Current Sensor with Overcurrent Fault Output for <100 V Isolation Applications, 3 to 5.5 V, -15.5 to 15.5 A IP, -40 to 125 degC, 12-Pin QFN (EX), RoHS, Tape and Reel; VCC Max: 5.5 V; IP Max: 15.5 A; VCC Min: 3 V; IP Min: -15.5 A; -3dB Bandwidth: 0.1 MHz; PackageDescription: 12-Pin Quad Flat No-Lead, Body 3 x 3 mm, Height 0.8 mm; ComponentLink1URL: http://www.allegromicro.com/; Packing: Tape and Reel; ComponentLink2URL: http://www.allegromicro.com/~/media/Files/Datasheets/ACS711-Datasheet.ashx?la=en; DatasheetVersion: Rev. 3; PartNumber: ACS711KEXLT-15AB-T; ComponentLink2Description: Datasheet; ComponentLink3URL: http://www.allegromicro.com/~/media/Files/Datasheets/ACS711-Datasheet.ashx?la=en; RoHS: TRUE; ComponentLink1Description: Manufacturer URL; ComponentLink3Description: Package Specification; Temperature Max: 125 degC; Mounting Technology: Surface Mount; Temperature Min: -40 degC
U5 = CMP-019-00052-2: Switching Regulator, Current-mode, 2A, 2600kHz Switching Freq-Max, PDSO14; Max Supply Voltage: 5.5V; Min Operating Temperature: -40°C; Max Operating Temperature: 85°C; Pins: 14; Case/Package: HVSON; RoHS Compliant: Yes
U6 = CMP-019-00049-1: 1.6-V to 5.5-V, 40-mΩ, 2.5-A, low-IQ, dual ideal diode 8-SOT-5X3 -40 to 125

## Sheet STM32G473CET6_PINOUT.SchDoc
size C; SheetNumber: 6; SheetTotal: 10
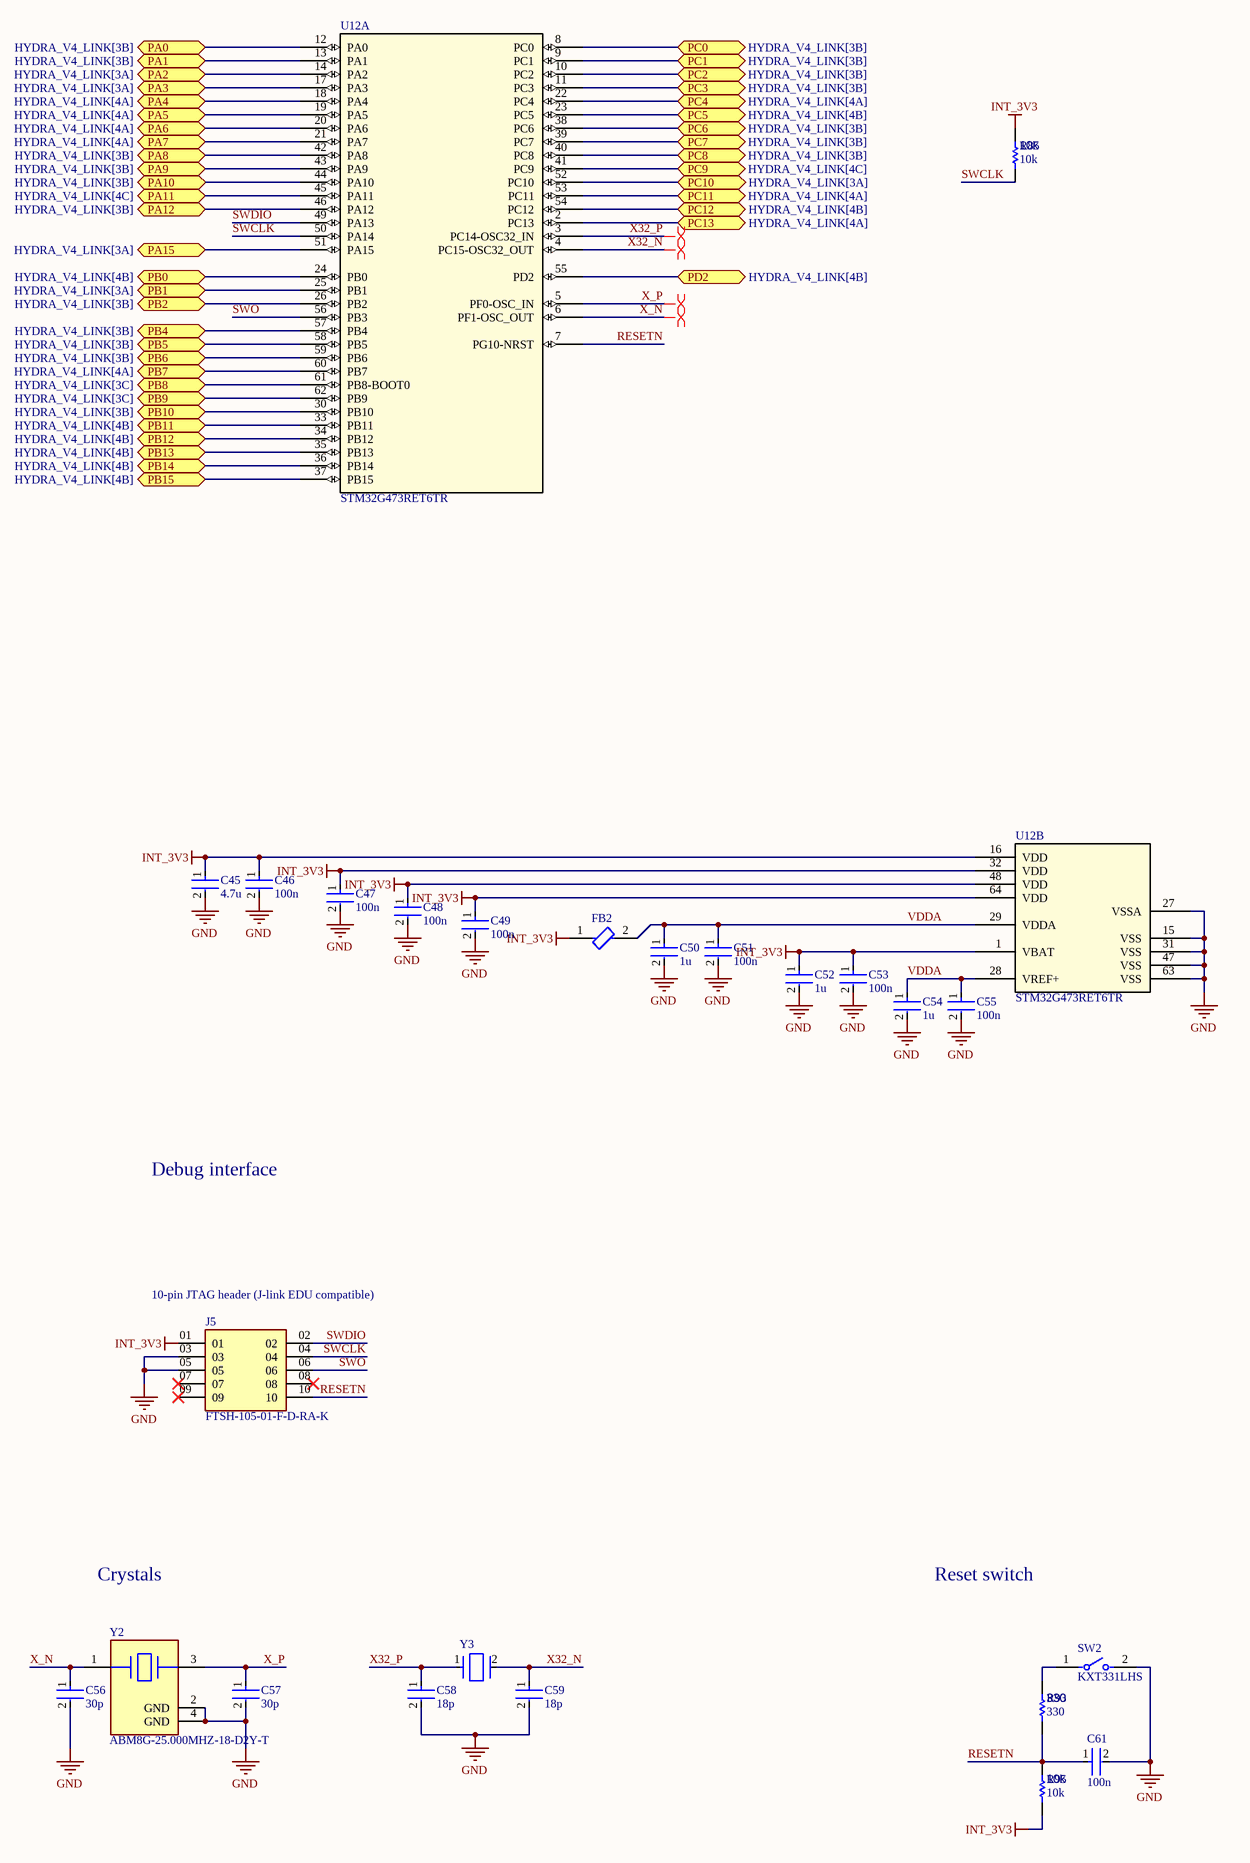
[diagram p3: STM32G473CET6_PINOUT.SchDoc]

### Parts
C45  4.7u  [FP-0402-L_1_0_0_05-W_0_5-IPC_A]
C46  100n  [FP-0402-L_1_0_0_05-W_0_5-IPC_A]
C47  100n  [FP-0402-L_1_0_0_05-W_0_5-IPC_A]
C48  100n  [FP-0402-L_1_0_0_05-W_0_5-IPC_A]
C49  100n  [FP-0402-L_1_0_0_05-W_0_5-IPC_A]
C50  1u  [FP-0402-L_1_0_0_05-W_0_5-IPC_A]
C51  100n  [FP-0402-L_1_0_0_05-W_0_5-IPC_A]
C52  1u  [FP-0402-L_1_0_0_05-W_0_5-IPC_A]
C53  100n  [FP-0402-L_1_0_0_05-W_0_5-IPC_A]
C54  1u  [FP-0402-L_1_0_0_05-W_0_5-IPC_A]
C55  100n  [FP-0402-L_1_0_0_05-W_0_5-IPC_A]
C56  30p  [FP-0402-L_1_0_0_05-W_0_5-IPC_A]
C57  30p  [FP-0402-L_1_0_0_05-W_0_5-IPC_A]
C58  18p  [FP-0402-L_1_0_0_05-W_0_5-IPC_A]
C59  18p  [FP-0402-L_1_0_0_05-W_0_5-IPC_A]
C61  100n  [FP-0402-L_1_0_0_05-W_0_5-IPC_A]
FB2  BLM15PX601SN1D  [FP-BLM15-0_05-MFG]  (value not drawn)
J5  FTSH-105-01-F-D-RA-K  [FTSH-105-01-F-D-RA-K-Footprint-1]
R85  10k  [R0603B]
R93  330  [R0603B]
R95  10k  [R0603B]
SW2  KXT331LHS  [FP-KXT331LHS-MFG]
U12  STM32G473RET6TR  [STM32G473RET6TR-Footprint-1]  (parts A,B of 2)
Y2  ABM8G-25.000MHZ-18-D2Y-T  [FP-ABM8G-MFG]
Y3  ECS-.327-12.5-1210-TR  [FP-ECX-1210-MFG]  (value not drawn)

### Ports
PA0 (bidir, see HYDRA_V4_LINK[3B]), PA1 (bidir, see HYDRA_V4_LINK[3B]), PA2 (bidir, see HYDRA_V4_LINK[3A]), PA3 (bidir, see HYDRA_V4_LINK[3A]), PA4 (bidir, see HYDRA_V4_LINK[4A]), PA5 (bidir, see HYDRA_V4_LINK[4A]), PA6 (bidir, see HYDRA_V4_LINK[4A]), PA7 (bidir, see HYDRA_V4_LINK[4A]), PA8 (bidir, see HYDRA_V4_LINK[3B]), PA9 (bidir, see HYDRA_V4_LINK[3B]), PA10 (bidir, see HYDRA_V4_LINK[3B]), PA11 (bidir, see HYDRA_V4_LINK[4C]), PA12 (bidir, see HYDRA_V4_LINK[3B]), PA15 (bidir, see HYDRA_V4_LINK[3A]), PB0 (bidir, see HYDRA_V4_LINK[4B]), PB1 (bidir, see HYDRA_V4_LINK[3A]), PB2 (bidir, see HYDRA_V4_LINK[3B]), PB4 (bidir, see HYDRA_V4_LINK[3B]), PB5 (bidir, see HYDRA_V4_LINK[3B]), PB6 (bidir, see HYDRA_V4_LINK[3B]), PB7 (bidir, see HYDRA_V4_LINK[4A]), PB8 (bidir, see HYDRA_V4_LINK[3C]), PB9 (bidir, see HYDRA_V4_LINK[3C]), PB10 (bidir, see HYDRA_V4_LINK[3B]), PB11 (bidir, see HYDRA_V4_LINK[4B]), PB12 (bidir, see HYDRA_V4_LINK[4B]), PB13 (bidir, see HYDRA_V4_LINK[4B]), PB14 (bidir, see HYDRA_V4_LINK[4B]), PB15 (bidir, see HYDRA_V4_LINK[4B]), PC0 (bidir, see HYDRA_V4_LINK[3B]), PC1 (bidir, see HYDRA_V4_LINK[3B]), PC2 (bidir, see HYDRA_V4_LINK[3B]), PC3 (bidir, see HYDRA_V4_LINK[3B]), PC4 (bidir, see HYDRA_V4_LINK[4A]), PC5 (bidir, see HYDRA_V4_LINK[4B]), PC6 (bidir, see HYDRA_V4_LINK[3B]), PC7 (bidir, see HYDRA_V4_LINK[3B]), PC8 (bidir, see HYDRA_V4_LINK[3B]), PC9 (bidir, see HYDRA_V4_LINK[4C]), PC10 (bidir, see HYDRA_V4_LINK[3A]), PC11 (bidir, see HYDRA_V4_LINK[4A]), PC12 (bidir, see HYDRA_V4_LINK[4B]), PC13 (bidir, see HYDRA_V4_LINK[4A]), PD2 (bidir, see HYDRA_V4_LINK[4B])

### Nets
GND: C45.2 C46.2 C47.2 C48.2 C49.2 C50.2 C51.2 C52.2 C53.2 C54.2 C55.2 C56.2 C57.2 C58.2 C59.2 C61.2 J5.03 J5.05 SW2.2 U12.15(VSS) U12.27(VSSA) U12.31(VSS) U12.47(VSS) U12.63(VSS) Y2.2(GND) Y2.4(GND)
INT_3V3: C45.1 C46.1 C47.1 C48.1 C49.1 C52.1 C53.1 FB2.1 J5.01 R85.2 R95.1 U12.1(VBAT) U12.16(VDD) U12.32(VDD) U12.48(VDD) U12.64(VDD)
BATT_TS: U12.38(PC6) ; port PC6
BST_nFLT: U12.44(PA10) ; port PA10
CHG_N: U12.39(PC7) ; port PC7
ETH_MISO: U12.20(PA6) ; port PA6
ETH_MOSI: U12.21(PA7) ; port PA7
ETH_nCS: U12.18(PA4) ; port PA4
ETH_nINT: U12.23(PC5) ; port PC5
ETH_nRST: U12.22(PC4) ; port PC4
ETH_SCLK: U12.19(PA5) ; port PA5
ISET2: U12.40(PC8) ; port PC8
MCU_G_LED: U12.41(PC9) ; port PC9
MCU_R_LED: U12.45(PA11) ; port PA11
nREG_FLT: U12.30(PB10) ; port PB10
RESETN: C61.1 J5.10 R93.1 R95.2 U12.7(PG10-NRST)
SD_CD: U12.33(PB11) ; port PB11
SD_CLK: U12.35(PB13) ; port PB13
SD_CMD: U12.37(PB15) ; port PB15
SD_CS: U12.34(PB12) ; port PB12
SD_DAT0: U12.36(PB14) ; port PB14
SWCLK: J5.04 R85.1 U12.50(PA14)
SWDIO: J5.02 U12.49(PA13)
SWO: J5.06 U12.56(PB3)
VDDA: C50.1 C51.1 C54.1 C55.1 FB2.2 U12.28(VREF+) U12.29(VDDA)
X32_N: C59.1 U12.4(PC15-OSC32_OUT) Y3.2(Out/In)
X32_P: C58.1 U12.3(PC14-OSC32_IN) Y3.1(In/Out)
X_N: C56.1 U12.6(PF1-OSC_OUT) Y2.1
X_P: C57.1 U12.5(PF0-OSC_IN) Y2.3
NetD4_1: U12.54(PC12) ; port PC12
NetD6_1: U12.55(PD2) ; port PD2
NetQ3_2: U12.52(PC10) ; port PC10
NetQ3_5: U12.51(PA15) ; port PA15
NetR3_1: U12.9(PC1) ; port PC1
NetR5_1: U12.8(PC0) ; port PC0
NetR11_1: U12.11(PC3) ; port PC3
NetR13_1: U12.10(PC2) ; port PC2
NetR24_2: U12.12(PA0) ; port PA0
NetR27_2: U12.46(PA12) ; port PA12
NetR28_2: U12.43(PA9) ; port PA9
NetR34_1: U12.60(PB7) ; port PB7
NetR42_1: U12.17(PA3) ; port PA3
NetR56_1: U12.25(PB1) ; port PB1
NetR58_2: U12.42(PA8) ; port PA8
NetR81_1: U12.24(PB0) ; port PB0
NetR83_1: U12.26(PB2) ; port PB2
NetR93_2: R93.2 SW2.1
NetU4_11: U12.13(PA1) ; port PA1
NetU7_4: U12.53(PC11) ; port PC11
NetU7_15: U12.2(PC13) ; port PC13
NetU8_11: U12.14(PA2) ; port PA2
NetU12_57: U12.57(PB4) ; port PB4
NetU12_58: U12.58(PB5) ; port PB5
NetU12_59: U12.59(PB6) ; port PB6
NetU12_61: U12.61(PB8-BOOT0) ; port PB8
NetU12_62: U12.62(PB9) ; port PB9

Not connected (* = marked no-connect by the designer): J5 07* 08* 09*

### Layout directives
differential pair: X32_N, X32_P, X_N, X_P

### Notes on the sheet
- Debug interface
- (near J5) 10-pin JTAG header (J-link EDU compatible)
- Crystals
- Reset switch

### Library data of the parts
C45-C59 C61 = CMP-001-00058-1: as C1 on sheet OC_PROT; Min Operating Temperature: -55°C; Mounting Technology: Surface Mount; Pins: 2; Case/Package: 0402; RoHS Compliant: Yes; Max Operating Temperature: 85°C
  C45: Value: 4.7u
  C46-C49 C51 C53 C55 C61: Value: 100n
  C50 C52 C54: Value: 1u
  C56 C57: Value: 30p
  C58 C59: Value: 18p
FB2 = CMP-0686-00252-4: Chip Ferrite Bead, 0402, 600Ω @ 100MHz, 0.23Ω, 25%, 900mA; Number of Circuits: 1; Impedance: 600R; DC Resistance (DCR): 230mR; Material: Steel; Length: 1mm; Package Quantity: 10000; Height: 0.5mm; Width: 0.5mm; Max DC Current: 900mA; Number of Lines: 1; Termination: SMD/SMT; Packaging: Tape and Reel; Lead Free: Lead Free; Min Operating Temperature: -55°C; Max Operating Temperature: 125°C; Max Current Rating: 900mA; Case Code (Imperial): 0402; Number of Pins: 2; Current Rating: 900mA; Test Frequency: 100MHz; Case/Package: 0402; Tolerance: 25%; Case Code (Metric): 1005
J5 = CMP-002-00041-5: Board Connector, 10 Contact(s), 2 Row(s), Male, Right Angle, 0.05 inch Pitch, Surface Mount Terminal, Locking, Black Insulator; Connector Type: BOARD CONNECTOR; Mounting Technology: Board; RoHS Compliant: Yes
R85 R93 R95 = CMP-009-00002-14: Resistor
  R85 R95: Value: 10k
  R93: Value: 330
SW2 = CMP-10040-000029-1: SWITCH TACTILE SPST-NO 0.02A 15V; Operating Force: 240gf; Switch Travel: 0.13mm; Illumination Type: Non-Illuminated; Throw Configuration: SPST; Number of Ports: 1; Current Rating: 5A; Mechanical Life: 500000Cycles; Switch Function: Off-Mom; Connector Type: USB; Actuator Type: Standard; Gender: Receptacle; Number of Contacts: 24; Contact Plating: Gold; Insulation Color: Black; Min Operating Temperature: -40°C; Packaging: Tape and Reel; Flammability Rating: UL94 V-0; Max Operating Temperature: 85°C; Termination: Solder; Mount: Surface Mount
U12 = CMP-020-00020-2: MCU 32-Bit STM32 ARM Cortex-M4 RISC 512KB Flash 1.71V to 3.6V 64-Pin LQFP T/R; RoHS Compliant: Yes
Y2 = CMP-2000-05733-3: Crystal 25MHz ±20ppm (Tol) ±30ppm (Stability) 18pF FUND 60Ω 4-Pin SMD T/R; Series Resistance: 60R; Length: 3.2mm; Depth: 2.5mm; Packaging: Tape and Reel; Min Operating Temperature: -40°C; Operating Frequency: 25 MHz; Lead Free: Lead Free; Number of Pins: 4; Frequency Tolerance: 20ppm; Radiation Hardening: No; Max Operating Temperature: 85°C; Termination: SMD/SMT; Frequency Stability: 30ppm; Frequency: 25MHz; Series: ABM8G; Mount: Surface Mount; Package Quantity: 1000; Height: 0.039inch; Width: 0.098inch; Case/Package: CSMD; ESR (Equivalent Series Resistance): 60R; Load Capacitance: 18pF; Tolerance: 20ppm
Y3 = CMP-40224-000006-1: CRYSTAL 32.7680KHZ 12.5PF SMD; Manufacturer: ECS International; Frequency: 32.768kHz; Esr: 90kΩ; Tolerance: 20ppm; Device Class L1: Passive Components; Load Capacitance: 12.5pF; Temperature: -40°C to +85°C; ComponentLink2URL: https://ecsxtal.com/store/pdf/ECX-1210.pdf; Series: ECX-1210; Octopart: https://octopart.com/ecs-.327-12.5-1210-tr-ecs+international-81221340; ComponentLink2Description: Datasheet; Temperature Range Low: -40°C; Digikey Description: CRYSTAL 32.7680KHZ 12.5PF SMD; Lead Free: Yes; RoHS: TRUE; Device Class L3: Crystals; Automotive: No; Category: Crys; Height: 0.5mm; Manufacturer Part Number: ECS-.327-12.5-1210-TR; Temperature Range High: +85°C; Device Class L2: Crystals / Oscillators; Package: ECX-1210

## Sheet SD.SchDoc
size A; SheetNumber: 5; SheetTotal: 10
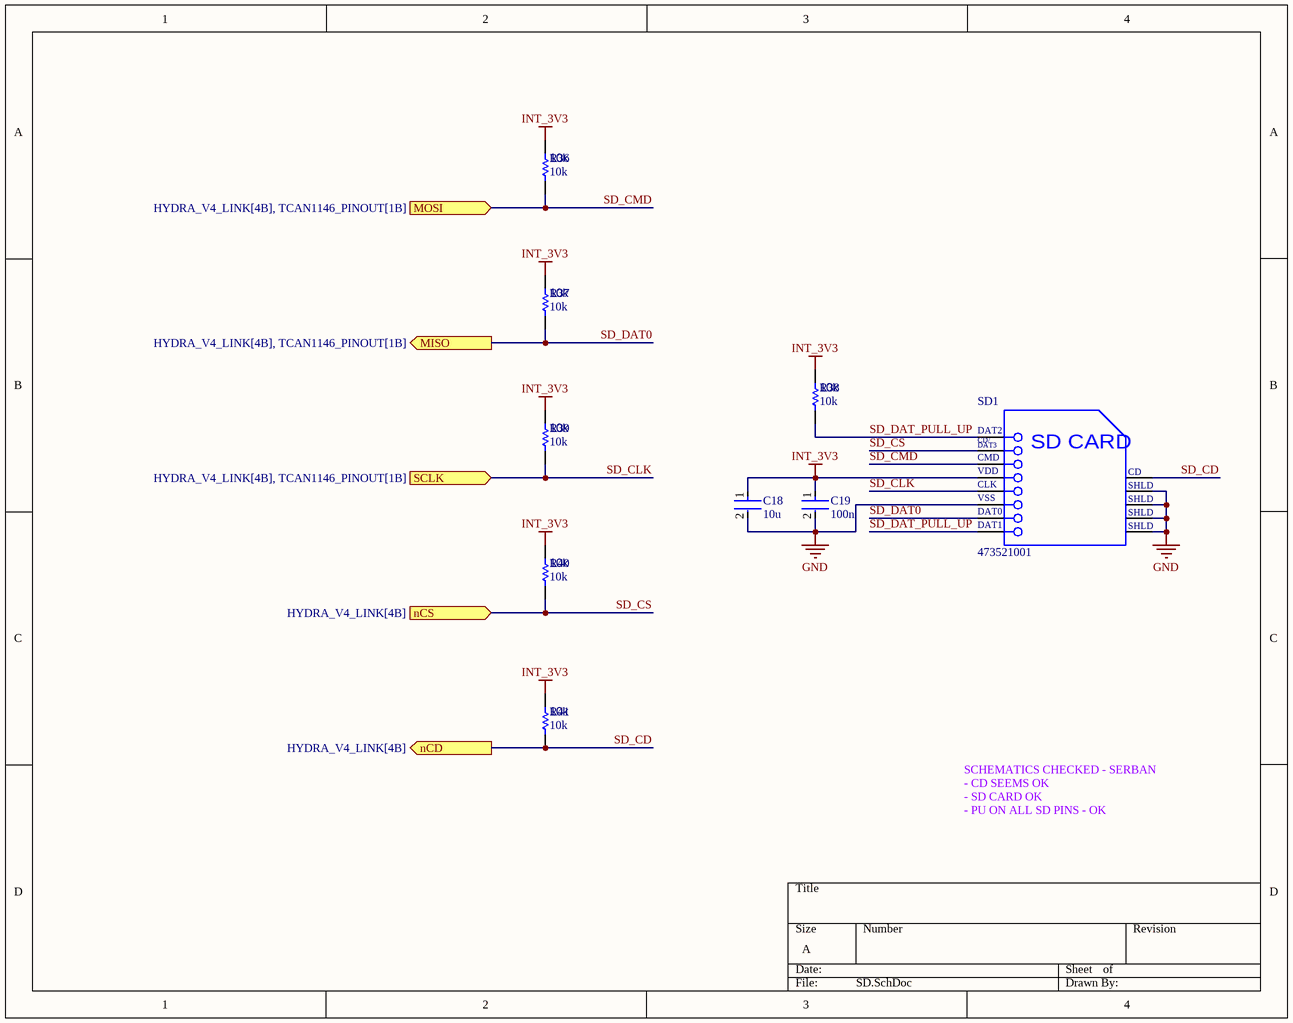
[diagram p4: SD.SchDoc]

### Parts
C18  10u  [FP-0402-L_1_0_0_05-W_0_5-IPC_A]
C19  100n  [FP-0402-L_1_0_0_05-W_0_5-IPC_A]
R36  10k  [R0603B]
R37  10k  [R0603B]
R38  10k  [R0603B]
R39  10k  [R0603B]
R40  10k  [R0603B]
R41  10k  [R0603B]
SD1  473521001  [MOLX-473521001_V]

### Ports
MISO (out, see HYDRA_V4_LINK[4B], TCAN1146_PINOUT[1B]), MOSI (in, see HYDRA_V4_LINK[4B], TCAN1146_PINOUT[1B]), nCD (out, see HYDRA_V4_LINK[4B]), nCS (in, see HYDRA_V4_LINK[4B]), SCLK (in, see HYDRA_V4_LINK[4B], TCAN1146_PINOUT[1B])

### Nets
GND: C18.2 C19.2 SD1.6(VSS) SD1.10(SHLD) SD1.11(SHLD) SD1.12(SHLD) SD1.13(SHLD)
INT_3V3: C18.1 C19.1 R36.1 R37.1 R38.1 R39.1 R40.1 R41.1 SD1.4(VDD)
SD_CD: R41.2 SD1.9(CD) ; port nCD
SD_CLK: R39.2 SD1.5(CLK) ; port SCLK
SD_CMD: R36.2 SD1.3(CMD) ; port MOSI
SD_CS: R40.2 SD1.2(CD/DAT3) ; port nCS
SD_DAT0: R37.2 SD1.7(DAT0) ; port MISO
SD_DAT_PULL_UP: R38.2 SD1.1(DAT2) SD1.8(DAT1)

### Notes on the sheet
- SCHEMATICS CHECKED - SERBAN
  - CD SEEMS OK
  - SD CARD OK
  - PU ON ALL SD PINS - OK
- (in symbol CMP-2000-05848-1) CD/; DAT3; SD CARD

### Library data of the parts
C18 C19 = CMP-001-00058-1: as C1 on sheet OC_PROT; Min Operating Temperature: -55°C; Mounting Technology: Surface Mount; Pins: 2; Case/Package: 0402; RoHS Compliant: Yes; Max Operating Temperature: 85°C
  C18: Value: 10u
  C19: Value: 100n
R36-R41 = CMP-009-00002-14: Resistor; Value: 10k
SD1 = CMP-2000-05848-1: MicroSD(TM), Pitch 1.1 mm, 8 Position, Height 1.88 mm, -20 to 85 degC, RoHS, Tape and Reel; Manufacturer: Molex; Datasheet Version: Rev. G, 01/2012; Datasheet URL: http://www.molex.com/pdm_docs/sd/473521001_sd.pdf; Package Reference: 473521001; Manufacturer URL: http://www.molex.com/; Mounting Technology: SurfaceMount; Package Description: MicroSD(TM), Pitch 1.1 mm, 8 Position, Height 1.88 mm

## Sheet RFD_PWR_MGMT.SchDoc
size C; SheetNumber: 7; SheetTotal: 10
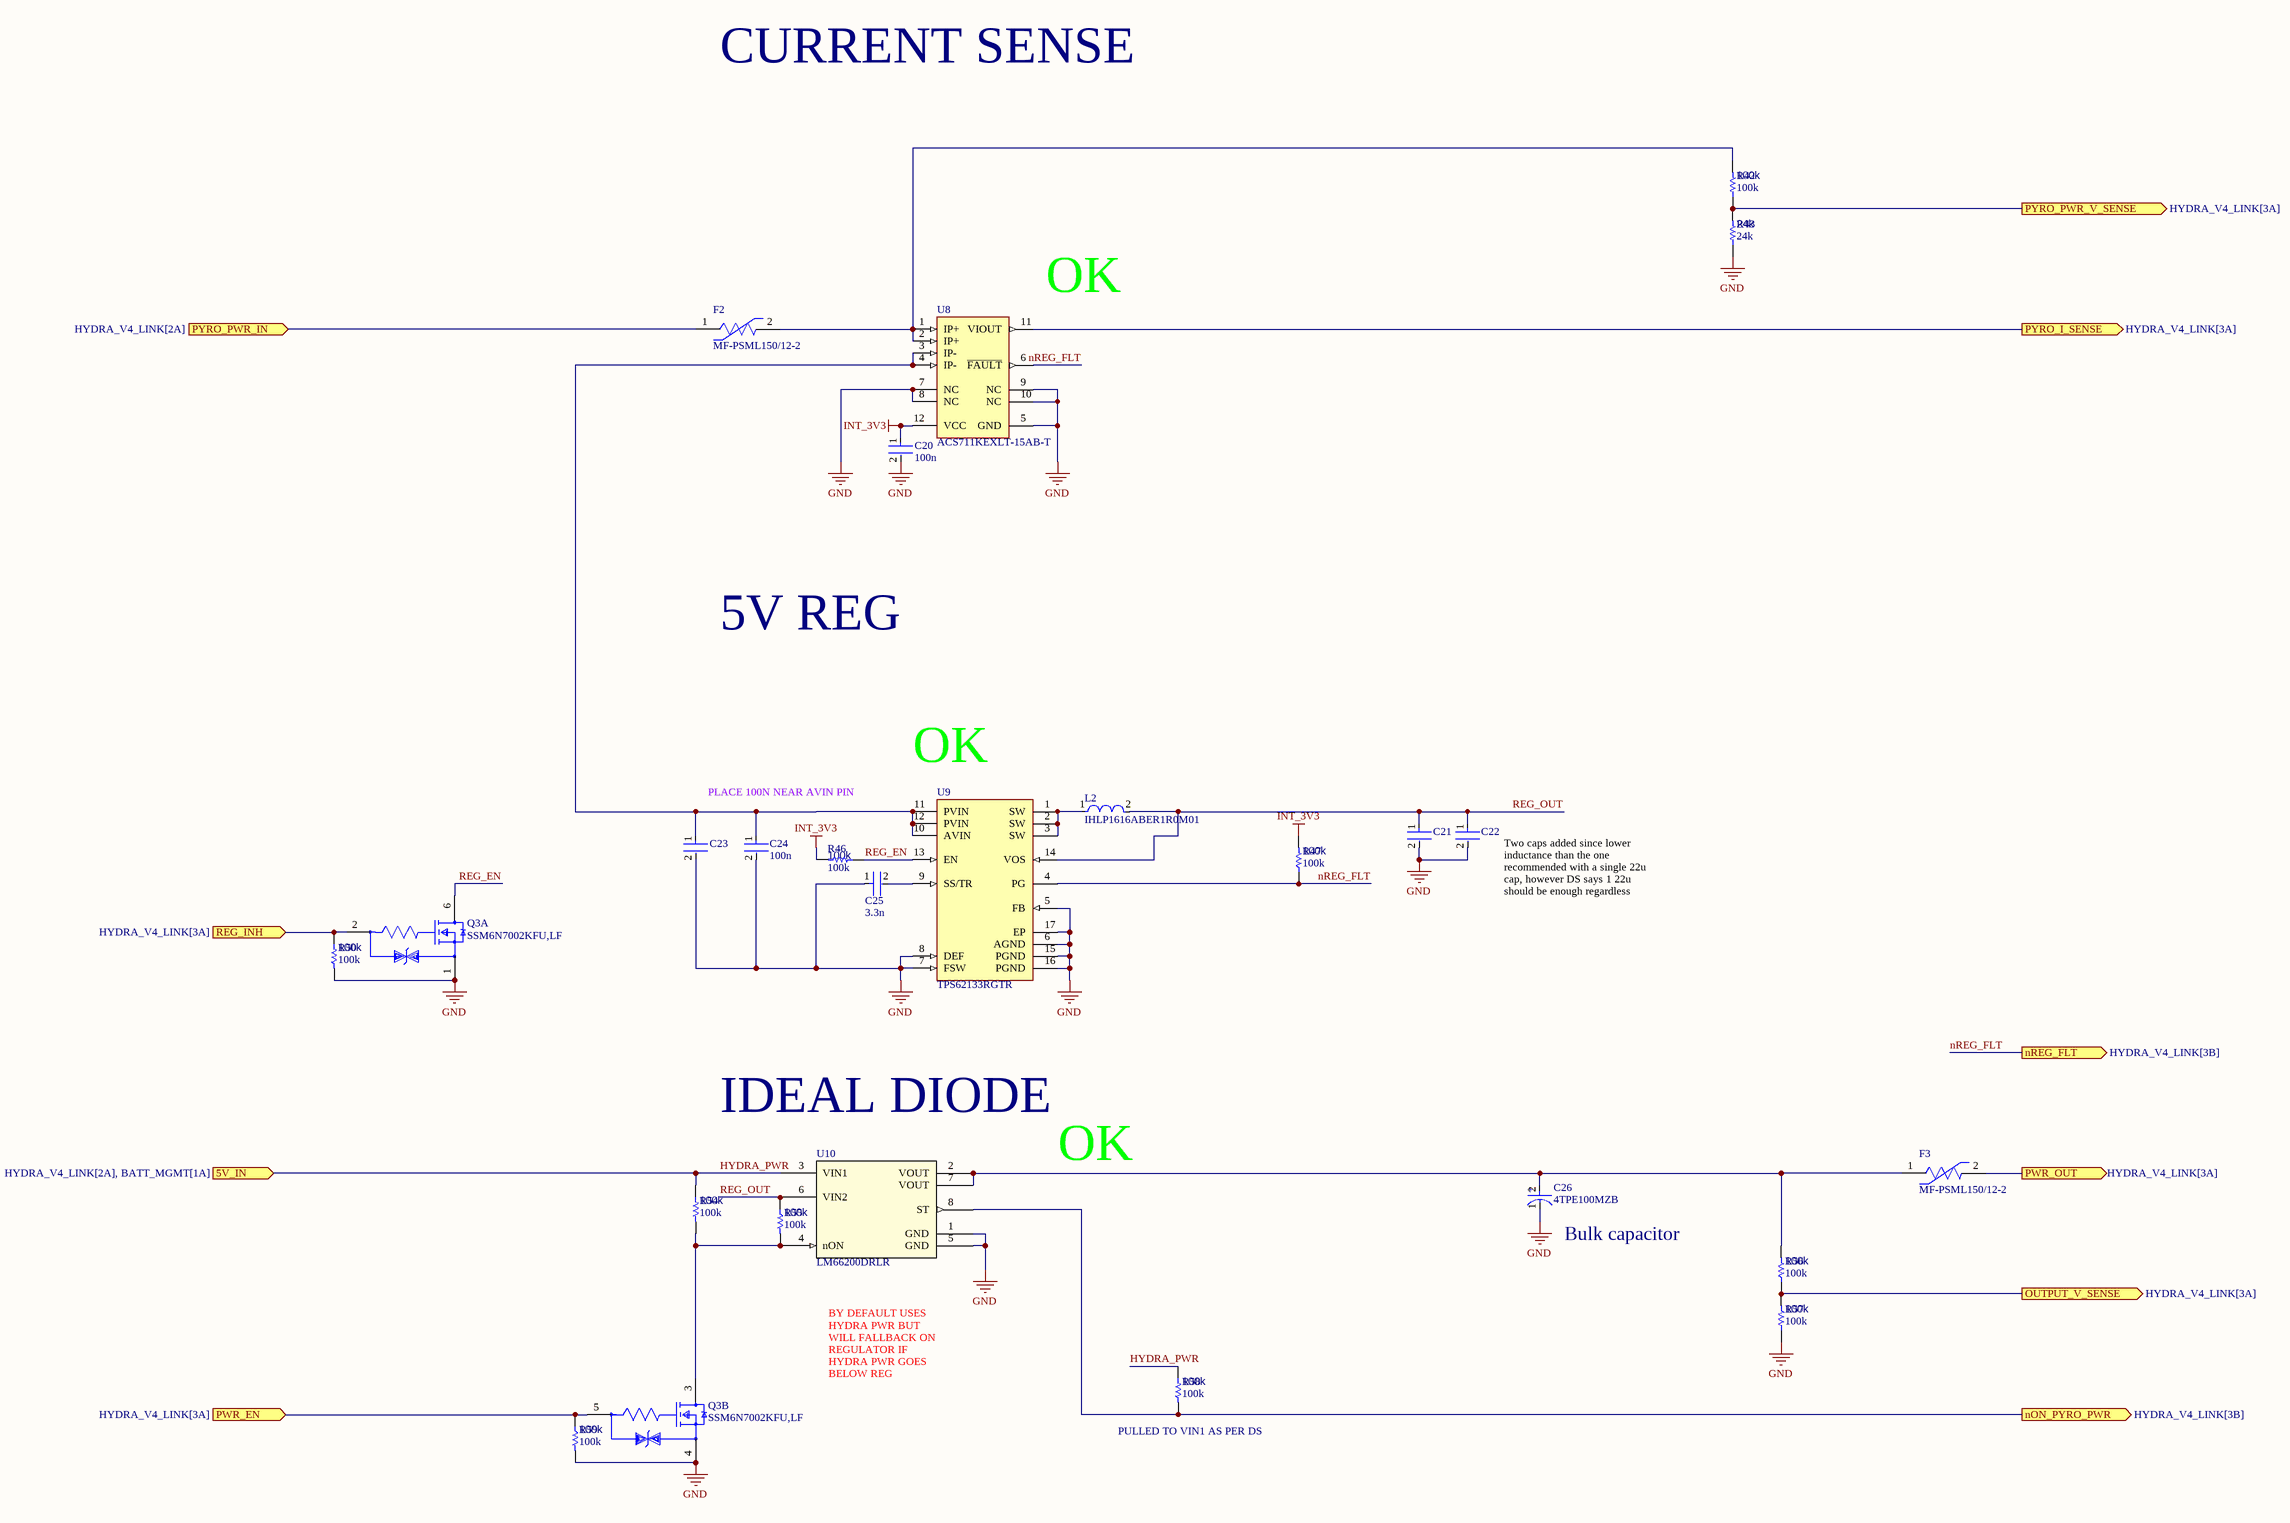
[diagram p5: RFD_PWR_MGMT.SchDoc]

### Parts
C20  100n  [FP-0402-L_1_0_0_05-W_0_5-IPC_A]
C21  GRM21BR61E226ME44L  [FP-GRM21B-0_2-e0_2_0_7-IPC_B]  (value not drawn)
C22  GRM21BR61E226ME44L  [FP-GRM21B-0_2-e0_2_0_7-IPC_B]  (value not drawn)
C23  TMK212BBJ106KG-T  [FP-0805-L_2_0_0_2-W_1_25-MFG]  (value not drawn)
C24  100n  [FP-0402-L_1_0_0_05-W_0_5-IPC_A]
C25  3.3n  [FP-0402-L_1_0_0_05-W_0_5-IPC_A]
C26  4TPE100MZB  [FP-POSCAP-B2-MFG]
F2  MF-PSML150/12-2  [FP-MF-PSMF-MFG]
F3  MF-PSML150/12-2  [FP-MF-PSMF-MFG]
L2  IHLP1616ABER1R0M01  [FP-IHLP-1616AB-FP_1_8545x-MFG]
Q3  SSM6N7002KFU,LF  [FP-SSOP6-P-0_65A-MFG]  (parts A,B of 2)
R42  100k  [R0603B]
R43  24k  [R0603B]
R46  100k  [R0603B]
R47  100k  [R0603B]
R50  100k  [R0603B]
R54  100k  [R0603B]
R55  100k  [R0603B]
R56  100k  [R0603B]
R57  100k  [R0603B]
R58  100k  [R0603B]
R59  100k  [R0603B]
U8  ACS711KEXLT-15AB-T  [ALEG-EX-12_V]
U9  TPS62133RGTR  [RGT0016C_V]
U10  LM66200DRLR  [LM66200DRLR-Footprint-1]

### Ports
5V_IN (in, see HYDRA_V4_LINK[2A], BATT_MGMT[1A]), nON_PYRO_PWR (out, see HYDRA_V4_LINK[3B]), nREG_FLT (out, see HYDRA_V4_LINK[3B]), OUTPUT_V_SENSE (out, see HYDRA_V4_LINK[3A]), PWR_EN (in, see HYDRA_V4_LINK[3A]), PWR_OUT (out, see HYDRA_V4_LINK[3A]), PYRO_I_SENSE (out, see HYDRA_V4_LINK[3A]), PYRO_PWR_IN (in, see HYDRA_V4_LINK[2A]), PYRO_PWR_V_SENSE (out, see HYDRA_V4_LINK[3A]), REG_INH (in, see HYDRA_V4_LINK[3A])

### Nets
AUX_RADIO_PWR: F3.2 ; port PWR_OUT
GND: C20.2 C21.2 C22.2 C23.2 C24.2 C25.1 C26.1(C) Q3.1(Source1) Q3.4(Source2) R43.1 R50.2 R57.1 R59.2 U8.5(GND) U8.7(NC) U8.8(NC) U8.9(NC) U8.10(NC) U9.5(FB) U9.6(AGND) U9.7(FSW) U9.8(DEF) U9.15(PGND) U9.16(PGND) U9.17(EP) U10.1(GND) U10.5(GND)
HYDRA_PWR: R54.1 R58.1 U10.3(VIN1) ; port 5V_IN  [project net 5V]
INT_3V3: C20.1 R46.2 R47.2 U8.12(VCC)
nREG_FLT: R47.1 U8.6(~{FAULT}) U9.4(PG) ; port nREG_FLT
PYRO_PWR: F2.1 ; port PYRO_PWR_IN
REG_EN: Q3.6(Drain1) R46.1 U9.13(EN)
REG_OUT: C21.1 C22.1 L2.2 R55.1 U9.14(VOS) U10.6(VIN2)
NetC23_1: C23.1 C24.1 U8.3(IP-) U8.4(IP-) U9.10(AVIN) U9.11(PVIN) U9.12(PVIN)
NetC25_2: C25.2 U9.9(SS/TR)
NetC26_2: C26.2(A) F3.1 R56.2 U10.2(VOUT) U10.7(VOUT)
NetF2_2: F2.2 R42.2 U8.1(IP+) U8.2(IP+)
NetL2_1: L2.1 U9.1(SW) U9.2(SW) U9.3(SW)
NetQ3_2: Q3.2(Gate1) R50.1 ; port REG_INH
NetQ3_3: Q3.3(Drain2) R54.2 R55.2 U10.4(nON)
NetQ3_5: Q3.5(Gate2) R59.1 ; port PWR_EN
NetR42_1: R42.1 R43.2 ; port PYRO_PWR_V_SENSE
NetR56_1: R56.1 R57.2 ; port OUTPUT_V_SENSE
NetR58_2: R58.2 U10.8(ST) ; port nON_PYRO_PWR
NetU8_11: U8.11(VIOUT) ; port PYRO_I_SENSE

### Notes on the sheet
- CURRENT SENSE
- (near U8) OK
- 5V REG
- (near U9) OK
- PLACE 100N NEAR AVIN PIN
- (near C22) Two caps added since lower inductance than the one recommended with a single 22u cap, however DS says 1 22u should be enough regardless
- IDEAL DIODE
- OK
- (near C26) Bulk capacitor
- BY DEFAULT USES HYDRA PWR BUT WILL FALLBACK ON REGULATOR IF HYDRA PWR GOES BELOW REG
- (near R58) PULLED TO VIN1 AS PER DS
- (in symbol CMP-05428-001141-1) +

### Library data of the parts
C20 C24 C25 = CMP-001-00058-1: as C1 on sheet OC_PROT; Min Operating Temperature: -55°C; Mounting Technology: Surface Mount; Pins: 2; Case/Package: 0402; RoHS Compliant: Yes; Max Operating Temperature: 85°C
  C20 C24: Value: 100n
  C25: Value: 3.3n
C21 C22 = CMP-2007-03222-3: Chip Multilayer Ceramic Capacitors for General Purpose, 0805, 22uF, X5R, 15%, 20%, 25V; Case/Package: 0805; Depth: 1.25mm; Resistor Type: Ceramic; Voltage Rating: 25V; Lead Free: Lead Free; Voltage Rating (DC): 25V; Case Code (Metric): 2012; Thickness: 0.057inch; REACH SVHC: No SVHC; Material: Ceramic; Tolerance: 20%; Length: 2mm; Capacitance: 22uF; Case Code (Imperial): 0805; Max Operating Temperature: 85°C; Termination: SMD/SMT; Weight: 0.000335oz; Dielectric: X5R; Packaging: Tape and Reel; Voltage: 25V; Package Quantity: 3000; Height: 1.25mm; Mount: Surface Mount; Width: 1.25mm; Min Operating Temperature: -55°C; Value: GRM21BR61E226ME44L
C23 = CMP-14477-000079-3: Multilayer Ceramic Capacitor 10uF 25V X5R 10% SMD 0805 T/R; Voltage: 16V; Dielectric: X7R; Number of Pins: 2; Width: 0.049inch; REACH SVHC: No SVHC; Packaging: Tape and Reel; Max Operating Temperature: 85°C; Length: 0.079inch; Termination: SMD/SMT; RoHS Compliant: Yes; Thickness: 0.053inch; Case/Package: 0805; Case Code (Imperial): 0805; Capacitance: 10uF; Lead Free: Lead Free; Voltage Rating: 25V; Resistor Type: Ceramic; Voltage Rating (DC): 25V; Case Code (Metric): 2012; Mount: Surface Mount; Package Quantity: 1; Height: 1.25mm; Series: M; Tolerance: 10%; Min Operating Temperature: -55°C; Value: TMK212BBJ106KG-T
C26 = CMP-05428-001141-1: as C15 on sheet BATT_MGMT; Capacitance: 100uF; Voltage: 4V; Voltage Rating (DC): 4V; Package Quantity: 2000; Packaging: Tape and Reel; RoHS Compliant: Yes; Voltage Rating: 4V; Case Code (Imperial): 1210; Construction: Flat; Max Operating Temperature: 105°C; Termination: SMD/SMT; Case Code (Metric): 3528; Case/Package: Molded; Tolerance: 20%; Min Operating Temperature: -55°C; Lead Free: Lead Free; Features: General Purpose; Height: 1.9mm; Length: 3.5mm; Series: POSCAP™ TPE; Number of Pins: 2; Height - Seated (Max): 0.079inch; Mount: Surface Mount; Width: 2.8mm; REACH SVHC: No SVHC; Radiation Hardening: No; Depth: 2.8mm; Value: 4TPE100MZB
F2 F3 = CMP-07400-000013-1: as F1 on sheet BATT_MGMT; Category: Fuse; Temperature: -40°C to +85°C; ComponentLink2Description: Datasheet; Temperature Range High: +85°C; Package: MF-PSMF; Device Class L1: Circuit Protection; Lead Free: Yes; ComponentLink2URL: https://www.bourns.com/docs/product-datasheets/mfpsmf.pdf?sfvrsn=9c05cafe_24; Ambient Temperature Range Low: -40°C; Mouser Description: Resettable Fuses - PPTC .50A 6V 0.15ohm Hold .5 Trip 1; Resistance: 0.15-0.9Ω; Automotive: Yes; Ambient Temperature Range High: +85°C; Device Class L2: PTC Resettable Fuses; Temperature Range Low: -40°C; Device Class L3: unset; Octopart: https://octopart.com/mf-psmf050x-2-bourns-7483438; Digikey Description: PTC RESET FUSE 6V 500MA 0805; Height: 0.85mm; RoHS: TRUE
L2 = CMP-02424-000161-1: as L1 on sheet BATT_MGMT; Radiation Hardening: No; Height - Seated (Max): 0.047inch; Case Code (Imperial): 1616; Case Code (Metric): 4040; Width: 0.16inch; Case/Package: 1616; Depth: 4.31mm; Height: 1.2mm; Inductance Tolerance: 20%; Lead Free: Lead Free; Termination: SMD/SMT; Military Standard: Not; RMS Current (Irms): 4A; Inductance: 1uH; Length: 4.7mm; Package Quantity: 4000; Number of Pins: 1616; Max Operating Temperature: 125°C; Contact Plating: Tin; Tolerance: 20%; Packaging: Tape and Reel; Current Rating: 4A; Min Operating Temperature: -55°C; Mount: Surface Mount
Q3 = CMP-006-0005-1: as Q5 on sheet OC_PROT; Mounting Technology: Surface Mount; Continuous Drain Current (ID): 300mA; Drain to Source Voltage (Vdss): 60V; Packaging: Cut Tape; Series: -
R42 R43 R46 R47 R50 R54-R59 = CMP-009-00002-14: Resistor
  R42 R46 R47 R50 R54-R59: Value: 100k
  R43: Value: 24k
U8 = CMP-1557-00001-1: as U4 on sheet BATT_MGMT; PackageDescription: 12-Pin Quad Flat No-Lead, Body 3 x 3 mm, Height 0.8 mm; ComponentLink1URL: http://www.allegromicro.com/; Packing: Tape and Reel; ComponentLink2URL: http://www.allegromicro.com/~/media/Files/Datasheets/ACS711-Datasheet.ashx?la=en; DatasheetVersion: Rev. 3; PartNumber: ACS711KEXLT-15AB-T; ComponentLink2Description: Datasheet; ComponentLink3URL: http://www.allegromicro.com/~/media/Files/Datasheets/ACS711-Datasheet.ashx?la=en; RoHS: TRUE; ComponentLink1Description: Manufacturer URL; ComponentLink3Description: Package Specification; Temperature Max: 125 degC; Mounting Technology: Surface Mount; Temperature Min: -40 degC
U9 = CMP-0323-00146-3: Buck Step Down Regulator with 3 to 17 V Input and 5 V Output, -40 to 85 degC, 16-Pin QFN (RGT), Green (RoHS & no Sb/Br); Manufacturer: Texas Instruments; Preset Vout(V): 5; Regulated Outputs(#): 1; Synchronous Rectification: TRUE; Duty Cycle(Max)(%): 100; Vin(Min)(V): 3; Vin(Max)(V): 17; Rating: Catalog; SubFamily: Step-Down Regulator; Switch Current Limit(Typ)(A): 4.2; Iq(Typ)(mA): 0.017; ComponentLink1Description: Datasheet; PackageVersion: revH, Oct-2011; ComponentLink2URL: http://www.ti.com/litv/pdf/mpqf119g; Code_JEDEC: MO-220; ComponentLink2Description: Package Specification; Vout(Max)(V): 5; ComponentLink3URL: Samples URL:http://www.ti.com/product/tps62133#samples; PackageReference: RGT0016C; ComponentLink3Description: URL Link1; Mounting Technology: Surface Mount; DatasheetVersion: SLVSAG7; PartNumber: TPS62133RGTR; Iout(Max)(A): 3; Eco-Plan: Green (RoHS & no Sb/Br); PackageDescription: 16-Pin Plastic Quad Flat No-Lead, 3 x 3 mm Body, 0.5 mm Pitch, 1.7 x 1.7 mm Exposed Pad; Topology: Buck; Vout(Min)(V): 5; ComponentLink1URL: http://www.ti.com/general/docs/lit/getliterature.tsp?genericPartNumber=TPS62133&fileType=pdf
U10 = CMP-019-00049-1: as U6 on sheet BATT_MGMT